# Altium project ePBR25_ACU_Controller.PrjPCB (part 1 of 2)
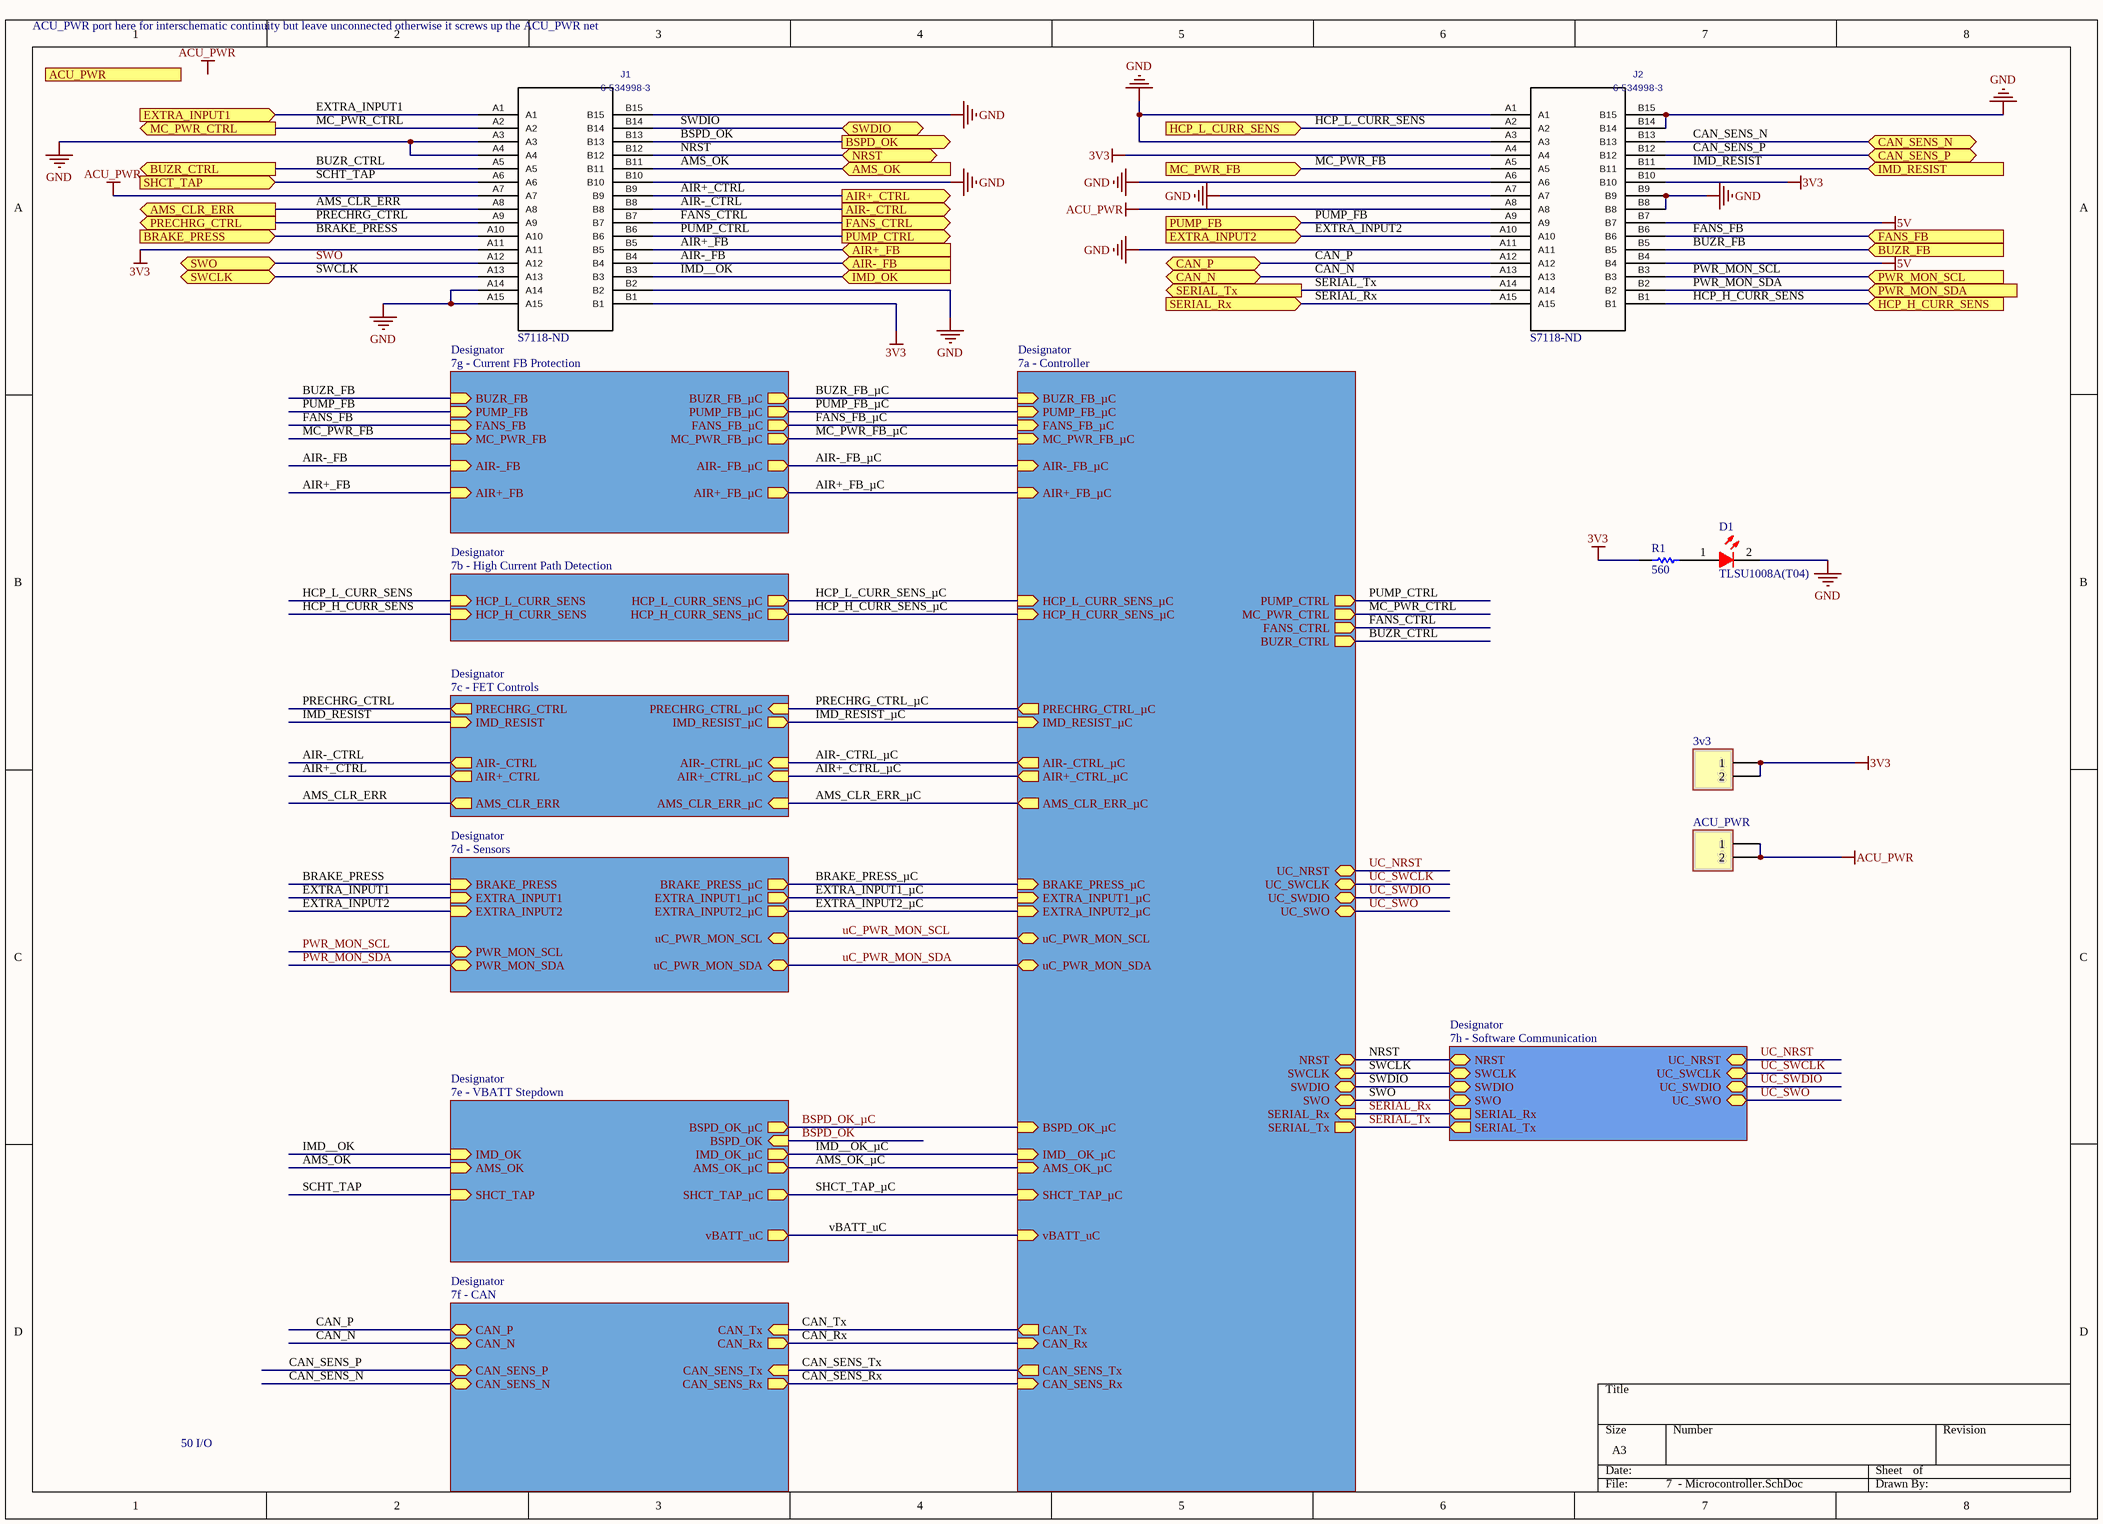
[diagram p0: 7  - Microcontroller.SchDoc]
9 sheets, 150 parts. Net scope: hierarchical (ports join the sheet entries above them; power ports are global).
Board file: ePBR25_ACU_Controller_rev0.PcbDoc
Sheets:
  7  - Microcontroller.SchDoc
    Designator = 7a - Controller.SchDoc
    Designator = 7b - High Current Path Detection.SchDoc
    Designator = 7c - FET Controls.SchDoc
    Designator = 7d - Sensors.SchDoc
    Designator = 7e - VBATT Stepdown.SchDoc
    Designator = 7f - CAN.SchDoc
    Designator = 7g - Current FB Protection.SchDoc
    Designator = 7h - Software Communication.SchDoc

## Sheet 7  - Microcontroller.SchDoc
size A3

### Parts
3v3  (no value)  [HDR1X2]
ACU_PWR  (no value)  [HDR1X2]
D1  TLSU1008A(T04)  [TOSH-0603LED_RED_V]
J1  6-534998-3  Supplier Part Number 1: S7118-ND  [6-534998-5_6-534998-5(Primary)]
J2  6-534998-3  Supplier Part Number 1: S7118-ND  [6-534998-5_6-534998-5(Primary)]
R1  560  [RESC0603(1608)_L]

### Sub-sheets
Designator = 7a - Controller: HCP_L_CURR_SENS_µC (in), HCP_H_CURR_SENS_µC (in), PRECHRG_CTRL_µC (out), IMD_RESIST_µC (in), AIR-_CTRL_µC (out), AIR+_CTRL_µC (out), AMS_CLR_ERR_µC (out), EXTRA_INPUT1_µC (in), EXTRA_INPUT2_µC (in), IMD__OK_µC (in), AMS_OK_µC (in), SHCT_TAP_µC (in), CAN_Tx (out), CAN_Rx (in), PUMP_CTRL (out), MC_PWR_CTRL (out), FANS_CTRL (out), BUZR_CTRL (out), NRST (bidir), SWCLK (bidir), SWDIO (bidir), BUZR_FB_µC (in), FANS_FB_µC (in), MC_PWR_FB_µC (in), PUMP_FB_µC (in), CAN_SENS_Tx (out), CAN_SENS_Rx (in), BRAKE_PRESS_µC (in), BSPD_OK_µC (in), SWO (bidir), UC_NRST (bidir), UC_SWCLK (bidir), UC_SWDIO (bidir), UC_SWO (bidir), uC_PWR_MON_SCL (bidir), AIR-_FB_µC (in), AIR+_FB_µC (in), uC_PWR_MON_SDA (bidir), SERIAL_Rx (in), SERIAL_Tx (out), vBATT_uC (in)
Designator = 7b - High Current Path Detection: HCP_L_CURR_SENS (in), HCP_H_CURR_SENS (in), HCP_L_CURR_SENS_µC (out), HCP_H_CURR_SENS_µC (out)
Designator = 7c - FET Controls: PRECHRG_CTRL (out), IMD_RESIST (in), AIR-_CTRL (out), AIR+_CTRL (out), AMS_CLR_ERR (out), PRECHRG_CTRL_µC (in), IMD_RESIST_µC (out), AIR-_CTRL_µC (in), AIR+_CTRL_µC (in), AMS_CLR_ERR_µC (in)
Designator = 7d - Sensors: EXTRA_INPUT1 (in), EXTRA_INPUT2 (in), EXTRA_INPUT1_µC (out), EXTRA_INPUT2_µC (out), BRAKE_PRESS (in), BRAKE_PRESS_µC (out), uC_PWR_MON_SCL (bidir), uC_PWR_MON_SDA (bidir), PWR_MON_SCL (bidir), PWR_MON_SDA (bidir)
Designator = 7e - VBATT Stepdown: IMD_OK (in), AMS_OK (in), SHCT_TAP (in), IMD_OK_µC (out), AMS_OK_µC (out), SHCT_TAP_µC (out), BSPD_OK (in), BSPD_OK_µC (out), vBATT_uC (out)
Designator = 7f - CAN: CAN_Tx (in), CAN_Rx (out), CAN_P (bidir), CAN_N (bidir), CAN_SENS_P (bidir), CAN_SENS_N (bidir), CAN_SENS_Tx (in), CAN_SENS_Rx (out)
Designator = 7g - Current FB Protection: BUZR_FB (in), PUMP_FB (in), FANS_FB (in), MC_PWR_FB (in), BUZR_FB_µC (out), PUMP_FB_µC (out), FANS_FB_µC (out), MC_PWR_FB_µC (out), AIR-_FB (in), AIR+_FB (in), AIR-_FB_µC (out), AIR+_FB_µC (out)
Designator = 7h - Software Communication: NRST (bidir), SWCLK (bidir), SWDIO (bidir), SWO (bidir), UC_NRST (bidir), UC_SWCLK (bidir), UC_SWDIO (bidir), UC_SWO (bidir), SERIAL_Rx (out), SERIAL_Tx (out)

### Ports
ACU_PWR (in), AIR+_CTRL (out), AIR+_FB (in), AIR-_CTRL (out), AIR-_FB (in), AMS_CLR_ERR (out), AMS_OK (in), BRAKE_PRESS (in), BSPD_OK (out), BUZR_CTRL (out), BUZR_FB (in), CAN_N (bidir), CAN_P (bidir), CAN_SENS_N (bidir), CAN_SENS_P (bidir), EXTRA_INPUT1 (in), EXTRA_INPUT2 (in), FANS_CTRL (out), FANS_FB (in), HCP_H_CURR_SENS (in), HCP_L_CURR_SENS (in), IMD_OK (in), IMD_RESIST (in), MC_PWR_CTRL (out), MC_PWR_FB (in), NRST (bidir), PRECHRG_CTRL (out), PUMP_CTRL (out), PUMP_FB (in), PWR_MON_SCL (in), PWR_MON_SDA (in), SERIAL_Rx (in), SERIAL_Tx (out), SHCT_TAP (in), SWCLK (bidir), SWDIO (bidir), SWO (bidir)

### Nets
3V3: 3v3.1 3v3.2 J1.A11 J1.B1 J2.A4 J2.B10 R1.1
5V: J2.B4 J2.B7
ACU_PWR: ACU_PWR.1 ACU_PWR.2 J1.A7 J2.A8
GND: D1.2(K) J1.A3 J1.A4 J1.A14 J1.A15 J1.B2 J1.B10 J1.B15 J2.A1 J2.A3 J2.A6 J2.A7 J2.A11 J2.B8 J2.B9 J2.B14 J2.B15
AIR+_CTRL: J1.B9 ; port AIR+_CTRL, sheet Designator/AIR+_CTRL
AIR+_CTRL_µC: sheet Designator/AIR+_CTRL_µC, sheet Designator/AIR+_CTRL_µC
AIR+_FB: J1.B5 ; port AIR+_FB, sheet Designator/AIR+_FB
AIR+_FB_µC: sheet Designator/AIR+_FB_µC, sheet Designator/AIR+_FB_µC
AIR-_CTRL: J1.B8 ; port AIR-_CTRL, sheet Designator/AIR-_CTRL
AIR-_CTRL_µC: sheet Designator/AIR-_CTRL_µC, sheet Designator/AIR-_CTRL_µC
AIR-_FB: J1.B4 ; port AIR-_FB, sheet Designator/AIR-_FB
AIR-_FB_µC: sheet Designator/AIR-_FB_µC, sheet Designator/AIR-_FB_µC
AMS_CLR_ERR: J1.A8 ; port AMS_CLR_ERR, sheet Designator/AMS_CLR_ERR
AMS_CLR_ERR_µC: sheet Designator/AMS_CLR_ERR_µC, sheet Designator/AMS_CLR_ERR_µC
AMS_OK: J1.B11 ; port AMS_OK, sheet Designator/AMS_OK
AMS_OK_µC: sheet Designator/AMS_OK_µC, sheet Designator/AMS_OK_µC
BRAKE_PRESS: J1.A10 ; port BRAKE_PRESS, sheet Designator/BRAKE_PRESS
BRAKE_PRESS_µC: sheet Designator/BRAKE_PRESS_µC, sheet Designator/BRAKE_PRESS_µC
BSPD_OK: J1.B13 ; port BSPD_OK, sheet Designator/BSPD_OK
BSPD_OK_µC: sheet Designator/BSPD_OK_µC, sheet Designator/BSPD_OK_µC
BUZR_CTRL: J1.A5 ; port BUZR_CTRL, sheet Designator/BUZR_CTRL
BUZR_FB: J2.B5 ; port BUZR_FB, sheet Designator/BUZR_FB
BUZR_FB_µC: sheet Designator/BUZR_FB_µC, sheet Designator/BUZR_FB_µC
CAN_N: J2.A13 ; port CAN_N, sheet Designator/CAN_N
CAN_P: J2.A12 ; port CAN_P, sheet Designator/CAN_P
CAN_Rx: sheet Designator/CAN_Rx, sheet Designator/CAN_Rx
CAN_SENS_N: J2.B13 ; port CAN_SENS_N, sheet Designator/CAN_SENS_N
CAN_SENS_P: J2.B12 ; port CAN_SENS_P, sheet Designator/CAN_SENS_P
CAN_SENS_Rx: sheet Designator/CAN_SENS_Rx, sheet Designator/CAN_SENS_Rx
CAN_SENS_Tx: sheet Designator/CAN_SENS_Tx, sheet Designator/CAN_SENS_Tx
CAN_Tx: sheet Designator/CAN_Tx, sheet Designator/CAN_Tx
EXTRA_INPUT1: J1.A1 ; port EXTRA_INPUT1, sheet Designator/EXTRA_INPUT1
EXTRA_INPUT1_µC: sheet Designator/EXTRA_INPUT1_µC, sheet Designator/EXTRA_INPUT1_µC
EXTRA_INPUT2: J2.A10 ; port EXTRA_INPUT2, sheet Designator/EXTRA_INPUT2
EXTRA_INPUT2_µC: sheet Designator/EXTRA_INPUT2_µC, sheet Designator/EXTRA_INPUT2_µC
FANS_CTRL: J1.B7 ; port FANS_CTRL, sheet Designator/FANS_CTRL
FANS_FB: J2.B6 ; port FANS_FB, sheet Designator/FANS_FB
FANS_FB_µC: sheet Designator/FANS_FB_µC, sheet Designator/FANS_FB_µC
HCP_H_CURR_SENS: J2.B1 ; port HCP_H_CURR_SENS, sheet Designator/HCP_H_CURR_SENS
HCP_H_CURR_SENS_µC: sheet Designator/HCP_H_CURR_SENS_µC, sheet Designator/HCP_H_CURR_SENS_µC
HCP_L_CURR_SENS: J2.A2 ; port HCP_L_CURR_SENS, sheet Designator/HCP_L_CURR_SENS
HCP_L_CURR_SENS_µC: sheet Designator/HCP_L_CURR_SENS_µC, sheet Designator/HCP_L_CURR_SENS_µC
IMD__OK: J1.B3 ; port IMD_OK, sheet Designator/IMD_OK
IMD__OK_µC: sheet Designator/IMD__OK_µC, sheet Designator/IMD_OK_µC
IMD_RESIST: J2.B11 ; port IMD_RESIST, sheet Designator/IMD_RESIST
IMD_RESIST_µC: sheet Designator/IMD_RESIST_µC, sheet Designator/IMD_RESIST_µC
MC_PWR_CTRL: J1.A2 ; port MC_PWR_CTRL, sheet Designator/MC_PWR_CTRL
MC_PWR_FB: J2.A5 ; port MC_PWR_FB, sheet Designator/MC_PWR_FB
MC_PWR_FB_µC: sheet Designator/MC_PWR_FB_µC, sheet Designator/MC_PWR_FB_µC
NRST: J1.B12 ; port NRST, sheet Designator/NRST, sheet Designator/NRST
PRECHRG_CTRL: J1.A9 ; port PRECHRG_CTRL, sheet Designator/PRECHRG_CTRL
PRECHRG_CTRL_µC: sheet Designator/PRECHRG_CTRL_µC, sheet Designator/PRECHRG_CTRL_µC
PUMP_CTRL: J1.B6 ; port PUMP_CTRL, sheet Designator/PUMP_CTRL
PUMP_FB: J2.A9 ; port PUMP_FB, sheet Designator/PUMP_FB
PUMP_FB_µC: sheet Designator/PUMP_FB_µC, sheet Designator/PUMP_FB_µC
PWR_MON_SCL: J2.B3 ; port PWR_MON_SCL, sheet Designator/PWR_MON_SCL
PWR_MON_SDA: J2.B2 ; port PWR_MON_SDA, sheet Designator/PWR_MON_SDA
SCHT_TAP: J1.A6 ; port SHCT_TAP, sheet Designator/SHCT_TAP
SERIAL_Rx: J2.A15 ; port SERIAL_Rx, sheet Designator/SERIAL_Rx, sheet Designator/SERIAL_Rx
SERIAL_Tx: J2.A14 ; port SERIAL_Tx, sheet Designator/SERIAL_Tx, sheet Designator/SERIAL_Tx
SHCT_TAP_µC: sheet Designator/SHCT_TAP_µC, sheet Designator/SHCT_TAP_µC
SWCLK: J1.A13 ; port SWCLK, sheet Designator/SWCLK, sheet Designator/SWCLK
SWDIO: J1.B14 ; port SWDIO, sheet Designator/SWDIO, sheet Designator/SWDIO
SWO: J1.A12 ; port SWO, sheet Designator/SWO, sheet Designator/SWO
UC_NRST: sheet Designator/UC_NRST, sheet Designator/UC_NRST
uC_PWR_MON_SCL: sheet Designator/uC_PWR_MON_SCL, sheet Designator/uC_PWR_MON_SCL
uC_PWR_MON_SDA: sheet Designator/uC_PWR_MON_SDA, sheet Designator/uC_PWR_MON_SDA
UC_SWCLK: sheet Designator/UC_SWCLK, sheet Designator/UC_SWCLK
UC_SWDIO: sheet Designator/UC_SWDIO, sheet Designator/UC_SWDIO
UC_SWO: sheet Designator/UC_SWO, sheet Designator/UC_SWO
vBATT_uC: sheet Designator/vBATT_uC, sheet Designator/vBATT_uC
NetD1_1: D1.1(A) R1.2

### Notes on the sheet
- ACU_PWR port here for interschematic continuity but leave unconnected otherwise it screws up the ACU_PWR net
- 50 I/O
- Labels drawn without touching a wire or pin: ACU_PWR

### Library data of the parts
3v3 ACU_PWR = Header 2: Header, 2-Pin; LatestRevisionDate: 17-Jul-2002; LatestRevisionNote: Re-released for DXP Platform.; Publisher: Altium Limited
D1 = CMP-0444-00001-1: LED, Red 0603 (1608) 63mCd; Manufacturer: Toshiba; Forward Current: 25 mA; Power Dissipation: 60 mW; Packing Type: Reel; Reverse Voltage: 4 V; Mounting Technology: Surface Mount; PackageDescription: 2-Pin SMT LED, 1.6 x 0.8 mm Pitch; ComponentLink1URL: http://www.toshiba-components.com/; ComponentLink1Description: Manufacturer URL; PackageReference: 0603LED_RED; PartNumber: TLSU1008A(T04); ComponentLink2URL: http://www.semicon.toshiba.co.jp/info/docget.jsp?type=datasheet&lang=en&pid=TLSU1008A(T04); ComponentLink2Description: Datasheet; DatasheetVersion: Aug-08; Storage Temperature: -40 to 100 degC
J1 J2 = 6-534998-3: C: Copyright (C) 2015 Accelerated Designs. All rights reserved; Vendor: TE Connectivity; Built_By: EMA_UL_Team; Value: 6-534998-3; Manufacturer_Part_Number: 6-534998-3; Supplier 1: Digi-Key
R1 = CMP-1591-00001-1: 0603 (1608 Metric) Chip Resistor; Case-Metric: 1608; Case-EIA: 0603; PackageReference: RESC0603(1608)

## Sheet 7a - Controller.SchDoc
size 355 x 241 mm
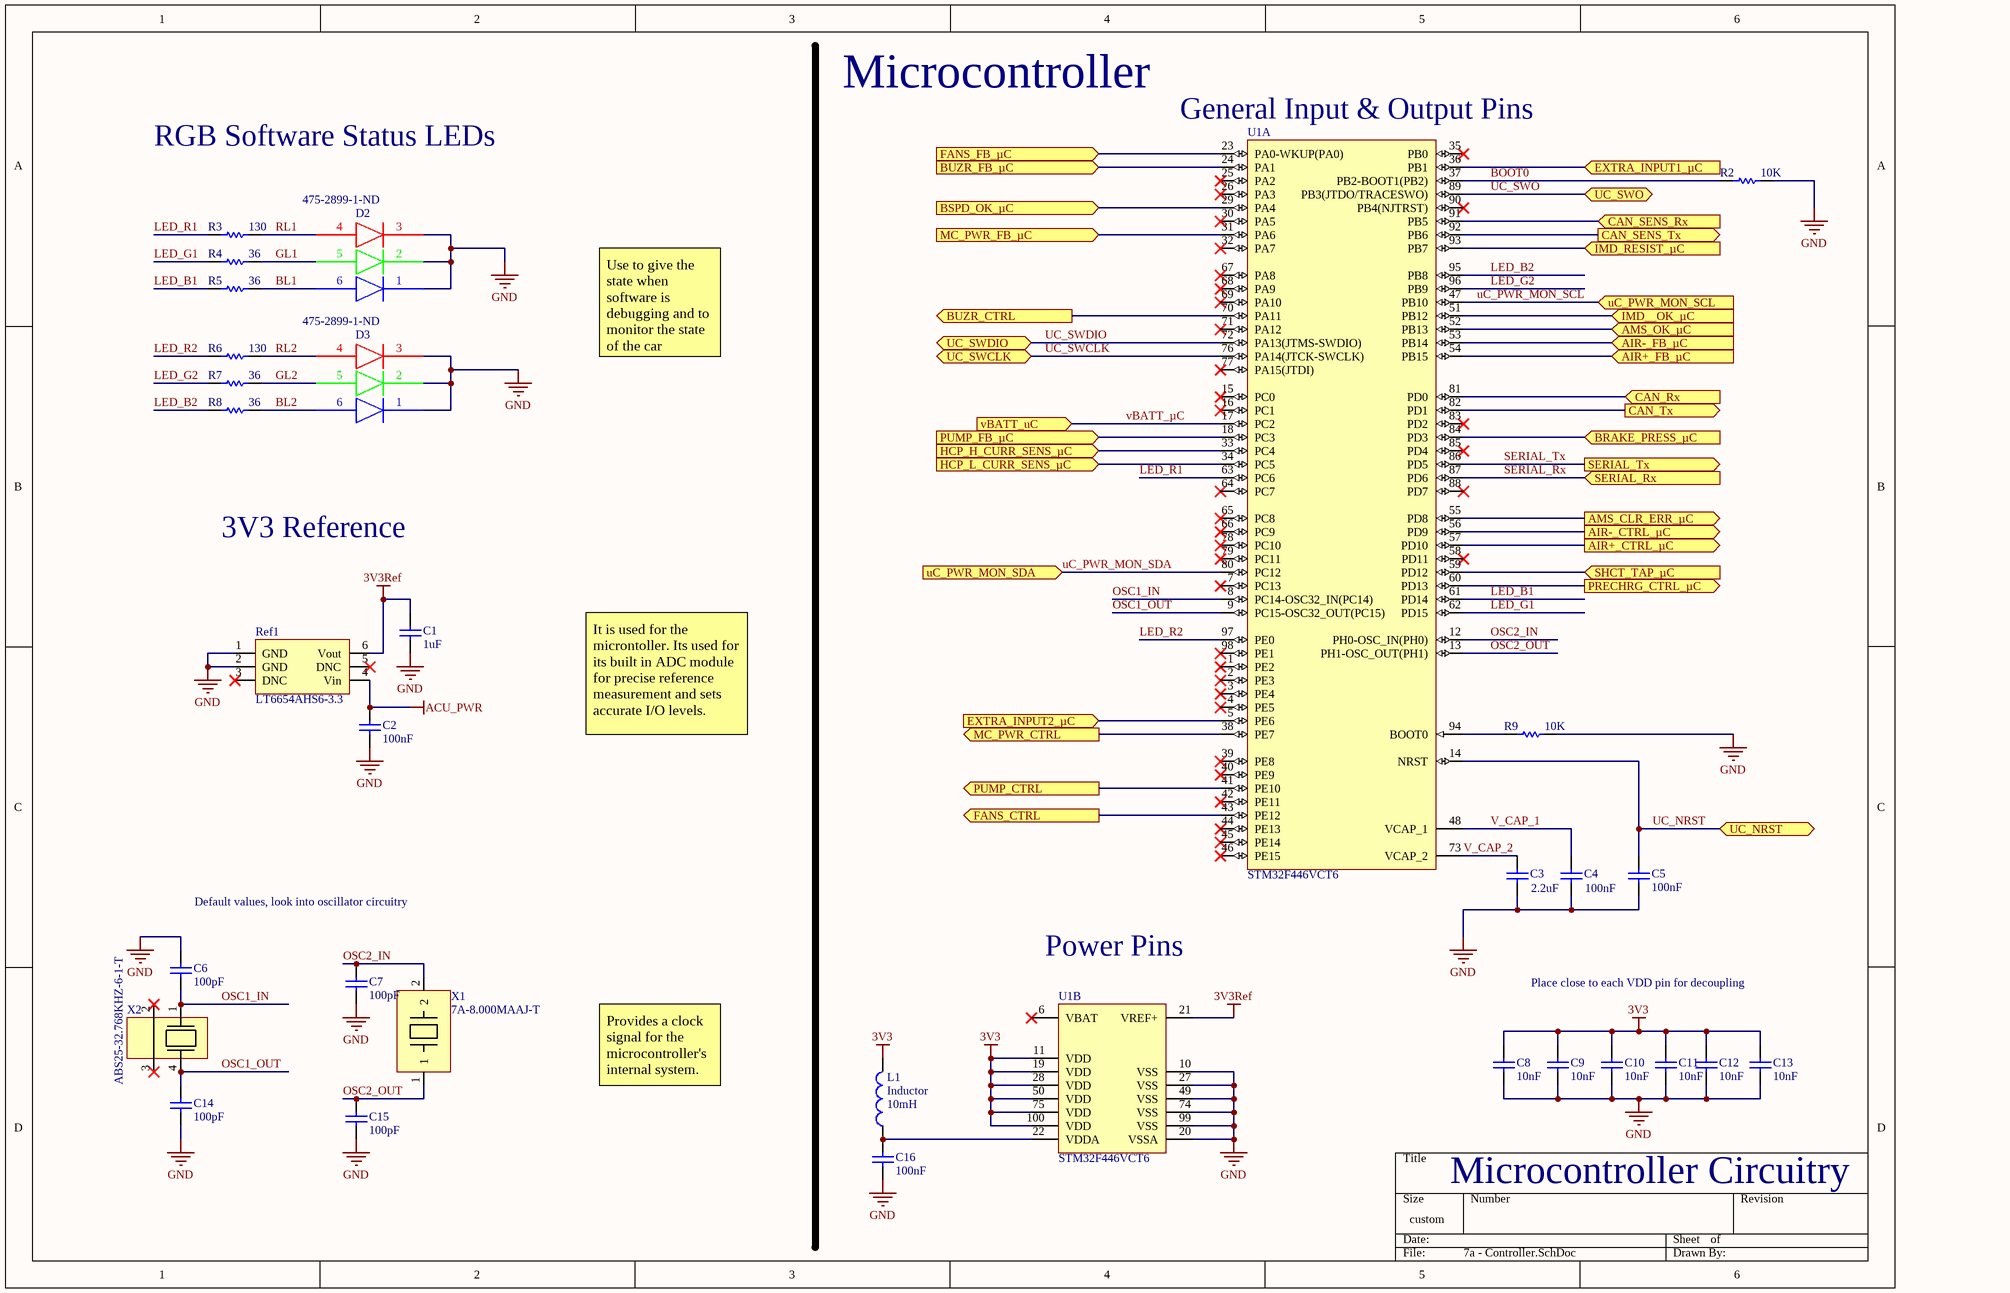
[diagram p1: 7a - Controller.SchDoc]

### Parts
C1  value 1uF  [1608[0603]]  (hidden comment: Cap)
C2  value 100nF  [1608[0603]]  (hidden comment: Cap)
C3  2.2uF  [CAPC0603(1608)100_N]
C4  100nF  [CAPC0603(1608)100_N]
C5  value 100nF  [1608[0603]]  (hidden comment: Cap)
C6  value 100pF  [1608[0603]]  (hidden comment: Cap)
C7  value 100pF  [1608[0603]]  (hidden comment: Cap)
C8  value 10nF  [1608[0603]]  (hidden comment: Cap)
C9  value 10nF  [1608[0603]]  (hidden comment: Cap)
C10  value 10nF  [1608[0603]]  (hidden comment: Cap)
C11  value 10nF  [1608[0603]]  (hidden comment: Cap)
C12  value 10nF  [1608[0603]]  (hidden comment: Cap)
C13  value 10nF  [1608[0603]]  (hidden comment: Cap)
C14  value 100pF  [1608[0603]]  (hidden comment: Cap)
C15  value 100pF  [1608[0603]]  (hidden comment: Cap)
C16  value 100nF  [1608[0603]]  (hidden comment: Cap)
D2  Supplier Part Number 1: 475-2899-1-ND  [CLX6C-FKB]
D3  Supplier Part Number 1: 475-2899-1-ND  [CLX6C-FKB]
L1  Inductor  value 10mH  [0402-A]
R2  value 10K  [1608[0603]]  (hidden comment: Res1)
R3  value 130  [1608[0603]]  (hidden comment: Res1)
R4  value 36  [1608[0603]]  (hidden comment: Res1)
R5  value 36  [1608[0603]]  (hidden comment: Res1)
R6  value 130  [1608[0603]]  (hidden comment: Res1)
R7  value 36  [1608[0603]]  (hidden comment: Res1)
R8  value 36  [1608[0603]]  (hidden comment: Res1)
R9  value 10K  [1608[0603]]  (hidden comment: Res1)
Ref1  LT6654AHS6-3.3  [TSOT-23]
U1  STM32F446VCT6  [STM-LQFP100_L]  (parts A,B of 2)
X1  7A-8.000MAAJ-T  [5 x 3.2 mm SMD]
X2  ABS25-32.768KHZ-6-1-T  [SOJ-4, 5.5mm Pitch]

### Ports
AIR+_CTRL_µC (out), AIR+_FB_µC (in), AIR-_CTRL_µC (out), AIR-_FB_µC (in), AMS_CLR_ERR_µC (out), AMS_OK_µC (in), BRAKE_PRESS_µC (in), BSPD_OK_µC (in), BUZR_CTRL (out), BUZR_FB_µC (in), CAN_Rx (in), CAN_SENS_Rx (in), CAN_SENS_Tx (out), CAN_Tx (out), EXTRA_INPUT1_µC (in), EXTRA_INPUT2_µC (in), FANS_CTRL (out), FANS_FB_µC (in), HCP_H_CURR_SENS_µC (in), HCP_L_CURR_SENS_µC (in), IMD__OK_µC (in), IMD_RESIST_µC (in), MC_PWR_CTRL (out), MC_PWR_FB_µC (in), PRECHRG_CTRL_µC (out), PUMP_CTRL (out), PUMP_FB_µC (in), SERIAL_Rx (in), SERIAL_Tx (out), SHCT_TAP_µC (in), UC_NRST (bidir), uC_PWR_MON_SCL (in), uC_PWR_MON_SDA (in), UC_SWCLK (bidir), UC_SWDIO (bidir), UC_SWO (bidir), vBATT_uC (in)

### Nets
3V3: C8.2 C9.2 C10.2 C11.2 C12.2 C13.2 L1.2 U1.11(VDD) U1.19(VDD) U1.28(VDD) U1.50(VDD) U1.75(VDD) U1.100(VDD)
3V3Ref: C1.2 Ref1.6(Vout) U1.21(VREF+)
ACU_PWR: C2.2 Ref1.4(Vin)
GND: C1.1 C2.1 C3.1 C4.1 C5.1 C6.2 C7.1 C8.1 C9.1 C10.1 C11.1 C12.1 C13.1 C14.1 C15.1 C16.1 D2.1(B) D2.2(G) D2.3(R) D3.1(B) D3.2(G) D3.3(R) R2.2 R9.2 Ref1.1(GND) Ref1.2(GND) U1.10(VSS) U1.20(VSSA) U1.27(VSS) U1.49(VSS) U1.74(VSS) U1.99(VSS)
AIR+_CTRL_µC: U1.57(PD10) ; port AIR+_CTRL_µC
AIR+_FB_µC: U1.54(PB15) ; port AIR+_FB_µC
AIR-_CTRL_µC: U1.56(PD9) ; port AIR-_CTRL_µC
AIR-_FB_µC: U1.53(PB14) ; port AIR-_FB_µC
AMS_CLR_ERR_µC: U1.55(PD8) ; port AMS_CLR_ERR_µC
AMS_OK_µC: U1.52(PB13) ; port AMS_OK_µC
BL1: D2.6(B) R5.2
BL2: D3.6(B) R8.2
BOOT0: R2.1 U1.37(PB2-BOOT1(PB2))
BRAKE_PRESS_µC: U1.84(PD3) ; port BRAKE_PRESS_µC
BSPD_OK_µC: U1.29(PA4) ; port BSPD_OK_µC
BUZR_CTRL: U1.70(PA11) ; port BUZR_CTRL
BUZR_FB_µC: U1.24(PA1) ; port BUZR_FB_µC
CAN_Rx: U1.81(PD0) ; port CAN_Rx
CAN_SENS_Rx: U1.91(PB5) ; port CAN_SENS_Rx
CAN_SENS_Tx: U1.92(PB6) ; port CAN_SENS_Tx
CAN_Tx: U1.82(PD1) ; port CAN_Tx
EXTRA_INPUT1_µC: U1.36(PB1) ; port EXTRA_INPUT1_µC
EXTRA_INPUT2_µC: U1.5(PE6) ; port EXTRA_INPUT2_µC
FANS_CTRL: U1.43(PE12) ; port FANS_CTRL
FANS_FB_µC: U1.23(PA0-WKUP(PA0)) ; port FANS_FB_µC
GL1: D2.5(G) R4.2
GL2: D3.5(G) R7.2
HCP_H_CURR_SENS_µC: U1.33(PC4) ; port HCP_H_CURR_SENS_µC
HCP_L_CURR_SENS_µC: U1.34(PC5) ; port HCP_L_CURR_SENS_µC
IMD__OK_µC: U1.51(PB12) ; port IMD__OK_µC
IMD_RESIST_µC: U1.93(PB7) ; port IMD_RESIST_µC
LED_B1: R5.1 U1.61(PD14)
LED_B2: R8.1 U1.95(PB8)
LED_G1: R4.1 U1.62(PD15)
LED_G2: R7.1 U1.96(PB9)
LED_R1: R3.1 U1.63(PC6)
LED_R2: R6.1 U1.97(PE0)
MC_PWR_CTRL: U1.38(PE7) ; port MC_PWR_CTRL
MC_PWR_FB_µC: U1.31(PA6) ; port MC_PWR_FB_µC
OSC1_IN: C6.1 U1.8(PC14-OSC32_IN(PC14)) X2.1
OSC1_OUT: C14.2 U1.9(PC15-OSC32_OUT(PC15)) X2.4
OSC2_IN: C7.2 U1.12(PH0-OSC_IN(PH0)) X1.2
OSC2_OUT: C15.2 U1.13(PH1-OSC_OUT(PH1)) X1.1
PRECHRG_CTRL_µC: U1.60(PD13) ; port PRECHRG_CTRL_µC
PUMP_CTRL: U1.41(PE10) ; port PUMP_CTRL
PUMP_FB_µC: U1.18(PC3) ; port PUMP_FB_µC
RL1: D2.4(R) R3.2
RL2: D3.4(R) R6.2
SERIAL_Rx: U1.87(PD6) ; port SERIAL_Rx
SERIAL_Tx: U1.86(PD5) ; port SERIAL_Tx
SHCT_TAP_µC: U1.59(PD12) ; port SHCT_TAP_µC
UC_NRST: C5.2 U1.14(NRST) ; port UC_NRST
uC_PWR_MON_SCL: U1.47(PB10) ; port uC_PWR_MON_SCL
uC_PWR_MON_SDA: U1.80(PC12) ; port uC_PWR_MON_SDA
UC_SWCLK: U1.76(PA14(JTCK-SWCLK)) ; port UC_SWCLK
UC_SWDIO: U1.72(PA13(JTMS-SWDIO)) ; port UC_SWDIO
UC_SWO: U1.89(PB3(JTDO/TRACESWO)) ; port UC_SWO
V_CAP_1: C4.2 U1.48(VCAP_1)
V_CAP_2: C3.2 U1.73(VCAP_2)
vBATT_µC: U1.17(PC2) ; port vBATT_uC  [project net vBATT_uC]
NetC16_2: C16.2 L1.1 U1.22(VDDA)
NetR9_1: R9.1 U1.94(BOOT0)

Not connected (* = marked no-connect by the designer): Ref1 3(DNC)* 5(DNC)*; U1 1(PE2)* 2(PE3)* 3(PE4)* 4(PE5)* 6(VBAT)* 7(PC13)* 15(PC0)* 16(PC1)* 25(PA2)* 26(PA3)* 30(PA5)* 32(PA7)* 35(PB0)* 39(PE8)* 40(PE9)* 42(PE11)* 44(PE13)* 45(PE14)* 46(PE15)* 58(PD11)* 64(PC7)* 65(PC8)* 66(PC9)* 67(PA8)* 68(PA9)* 69(PA10)* 71(PA12)* 77(PA15(JTDI))* 78(PC10)* 79(PC11)* 83(PD2)* 85(PD4)* 88(PD7)* 90(PB4(NJTRST))* 98(PE1)*; X2 2* 3*

### Notes on the sheet
- Microcontroller
- RGB Software Status LEDs
- (near U1) General Input & Output Pins
- Use to give the state when software is debugging and to monitor the state of the car
- 3V3 Reference
- It is used for the microntoller. Its used for its built in ADC module for precise reference measurement and sets accurate I/O levels.
- Default values, look into oscillator circuitry
- Power Pins
- Place close to each VDD pin for decoupling
- Provides a clock signal for the microcontroller's internal system.
- Microcontroller Circuitry

### Library data of the parts
C1 C2 C5-C16 = Cap: Capacitor; Published: 8-Jun-2000; LatestRevisionDate: 17-Jul-2002; LatestRevisionNote: Re-released for DXP Platform.; PackageReference: RAD-0.3; Publisher: Altium Limited; PackageDescription: Radial Cap, Thru-Hole; 2 Leads; 0.3 in Pin Spacing
C3 C4 = CMP-1035-02582-1: CAP 100nF 10V -20% to +80% 0603 (1608 Metric) Thickness 1mm SMD; Case-Metric: 1608; Case-EIA: 0603; Rated Voltage: 10 V; Value: 100nF; Technology: SMT; Max Thickness: 1 mm; Tolerance: -20% to +80%
D2 D3 = LED - CLX6C-FKB-CGJKNCFBB789363 RGB: Manufacturer: Cree Inc.; Color: Red, Green, Blue (RGB); Lens Color: White; Lens Transparency: Diffused; Millicandela Rating: 420mcd Red, 840mcd Green, 196mcd Blue; Lens Style/Size: Square with Flat Top, 1.00mm; Voltage - Forward (Vf) (Typ): 1.9V Red, 3V Green, 3V Blue; Current - Test: 8mA Red, 8mA Green, 8mA Blue; Wavelength - Dominant: 622nm Red, 531nm Green, 470nm Blue; Manufacturer Part Number: CLX6C-FKB-CGJKNCFBB789363; RoHS: RoHS Compliant; Category: Optoelectronics; Packaging: Cut Tape (CT); Part Status: Active; Viewing Angle: -; Mounting Type: Surface Mount; Wavelength - Peak: -; Features: -; Package / Case: 6-SMD, J-Lead; Supplier Device Package: 6-PLCC; Size / Dimension: 3.40mm L x 3.40mm W; Height (Max): 2.90mm; ComponentLink1URL: http://www.cree.com/~/media/Files/Cree/LED-Components-and-Modules/HB/Data-Sheets/1281-CLX6C-FKB.pdf; ComponentLink1Description: http://www.cree.com/~/media/Files/Cree/LED-Components-and-Modules/HB/Data-Sheets/1281-CLX6C-FKB.pdf; Supplier 1: Digi-Key
L1 = Inductor: Code_IEC: 1005; Published: 8-Jun-2000; LatestRevisionDate: 29-May-2009; LatestRevisionNote: IPC-7351 Footprint Added.; PackageReference: 0402-A; Publisher: Altium Limited; PackageDescription: Chip Inductor; Code_JEITA: 0402
R2-R9 = Res1: Resistor; Published: 8-Jun-2000; LatestRevisionDate: 17-Jul-2002; LatestRevisionNote: Re-released for DXP Platform.; PackageReference: AXIAL-0.3; Publisher: Altium Limited; PackageDescription: Axial Device, Thru-Hole; 2 Leads; 0.3 in Pin Spacing
Ref1 = LT6654AHS6-3.3: TSOT-23-56; Manufacturer: Linear Technology; Reference Type: Series; Output Type: Fixed; Voltage - Output (Min/Fixed): 3.3V; Current - Output: 10mA; Tolerance: ±0.05%; Temperature Coefficient: 10ppm/°C; Noise - 0.1Hz to 10Hz: 1.7ppmp-p; Noise - 10Hz to 10kHz: 2ppmrms; Voltage - Input: 3.8 V ~ 36 V; Current - Supply: 600µA; Manufacturer Part Number: LT6654AHS6-3.3; Digikey Part Number: LT6654AHS6-3.3#TRMPBFCT-ND; Digikey Link: http://www.digikey.com/product-detail/en/linear-technology/LT6654AHS6-3.3-TRMPBF/LT6654AHS6-3.3-TRMPBFCT-ND/2485839; Supplier 1: Digi-Key; Supplier Part Number 1: LT6654AHS6-3.3#TRMPBFCT-ND; RoHS: RoHS Compliant; Category: Integrated Circuits (ICs); Stock 1: 1315; Pricing 1: 1=9.53, 25=8.508, 100=5.5596, 250=5.1048 (CAD); Packaging: Cut Tape (CT); Part Status: Active; Voltage - Output (Max): -; Current - Cathode: -; Operating Temperature: -40°C ~ 125°C (TA); Mounting Type: Surface Mount; Package / Case: SOT-23-6 Thin, TSOT-23-6; Supplier Device Package: TSOT-23-6; ComponentLink1URL: http://www.linear.com/docs/29677; ComponentLink1Description: http://www.linear.com/docs/29677
U1 = CMP-0243-00219-1: ARM Cortex-M4 32-bit MCU+FPU, 256 KB Flash, 128 KB Internal RAM, 81 I/Os, 100-Pin LQFP, -40 to 85 degC, Tray; D/A Converter: 2; Operating Frequency(F) (Processor speed) (MHz): 180; I/Os (High Current): 81; Supply Voltage(Vcc) min (V): 1.7; Internal RAM Size (kB): 128; FLASH Size (Prog) (kB): 256; Package Reference: 100-Pin Low Profile Quad Flat Package, Body 14 x 14 mm, Pitch 0.5 mm; Packing: Tray; ComponentLink1URL: http://www.st.com/; ComponentLink1Description: Manufacturer URL; ComponentLink2URL: http://www.st.com/st-web-ui/static/active/en/resource/technical/document/datasheet/DM00141306.pdf; Mounting Technology: Surface Mount; DatasheetVersion: Rev. 6; ComponentLink2Description: Datasheet; Core: ARM Cortex-M4; Package Description: LQFP100
X1 = 8MHz crystal, 7A-8.000MAAJ-T: Manufacturer: TXC CORPORATION; Frequency: 8MHz; Frequency Stability: ±30ppm; Load Capacitance: 18pF; ESR (Equivalent Series Resistance): 80 Ohm; Operating Mode: Fundamental; Supplier 1: Digi-Key; Manufacturer Part Number: 7A-8.000MAAJ-T; RoHS: RoHS Compliant; Category: Crystals, Oscillators, Resonators; Stock 1: 30692; Pricing 1: 1=1.12, 10=0.989, 50=0.9234, 100=0.8162, 500=0.77322 (CAD); Packaging: Cut Tape (CT); Part Status: Active; Type: MHz Crystal; Frequency Tolerance: ±30ppm; Operating Temperature: -20°C ~ 70°C; Ratings: -; Mounting Type: Surface Mount; Package / Case: 2-SMD, No Lead; Size / Dimension: 0.197" L x 0.126" W (5.00mm x 3.20mm); Height - Seated (Max): 0.053" (1.35mm); ComponentLink1URL: http://www.txccrystal.com/images/pdf/7a.pdf; ComponentLink1Description: http://www.txccrystal.com/images/pdf/7a.pdf; Supplier Part Number 1: 887-1448-1-ND
X2 = ABS25-32.768KHZ-6-1-T: Manufacturer: Abracon LLC; Frequency Tolerance: ±10ppm; Load Capacitance: 6pF; ESR (Equivalent Series Resistance): 50 kOhm; Operating Mode: Fundamental; Frequency: 32.768kHz; Manufacturer Part Number: ABS25-32.768KHZ-6-1-T; Digikey Part Number: 535-10241-1-ND; Digikey Link: http://www.digikey.ca/product-detail/en/abracon-llc/ABS25-32.768KHZ-6-1-T/535-10241-1-ND/2218054; Supplier 1: Digi-Key; Supplier Part Number 1: 535-10241-1-ND; RoHS: RoHS Compliant; Category: Crystals, Oscillators, Resonators; Stock 1: 47244; Pricing 1: 1=1, 10=0.837, 50=0.7538, 100=0.6701, 500=0.63664, 1000=0.5361 (CAD); Packaging: Cut Tape (CT); Part Status: Active; Type: kHz Crystal (Tuning Fork); Frequency Stability: -; Operating Temperature: -40°C ~ 85°C; Ratings: -; Mounting Type: Surface Mount; Package / Case: 4-SOJ, 5.50mm pitch; Size / Dimension: 0.315" L x 0.150" W (8.00mm x 3.80mm); Height - Seated (Max): 0.098" (2.50mm); ComponentLink1URL: http://www.abracon.com/Resonators/abs25.pdf; ComponentLink1Description: http://www.abracon.com/Resonators/abs25.pdf

## Sheet 7b - High Current Path Detection.SchDoc
size A4
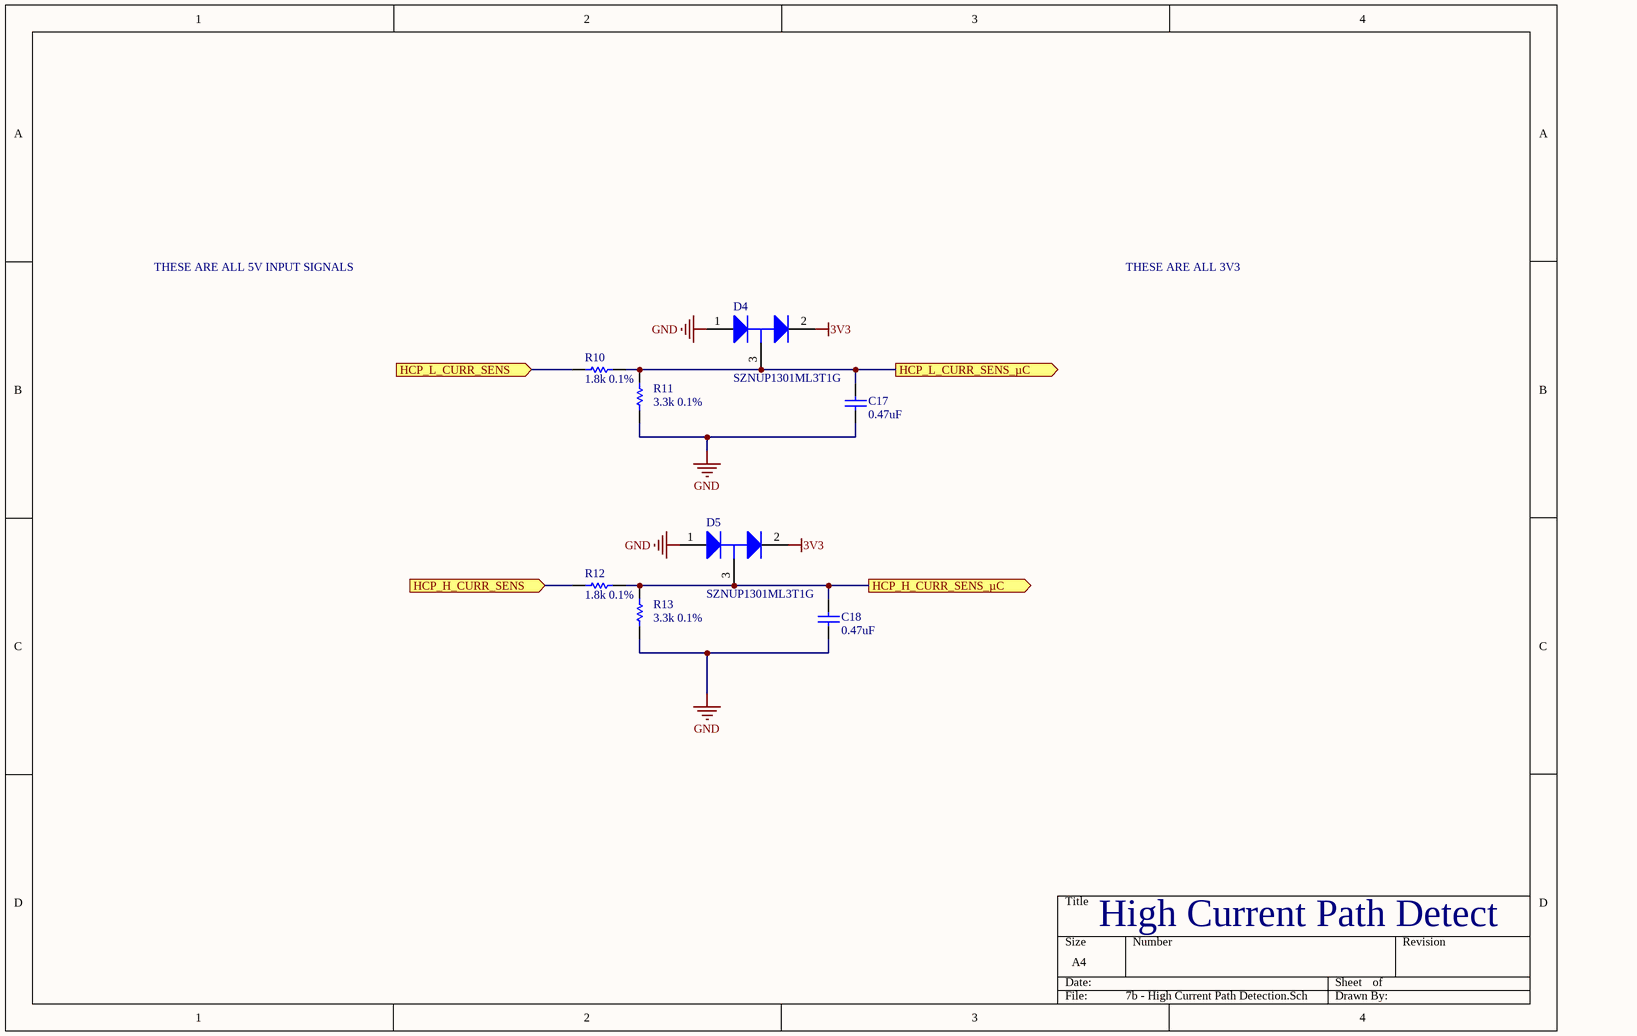
[diagram p2: 7b - High Current Path Detection.SchDoc]

### Parts
C17  value 0.47uF  [1608[0603]]  (hidden comment: Cap)
C18  value 0.47uF  [1608[0603]]  (hidden comment: Cap)
D4  SZNUP1301ML3T1G  [ONSC-SOT-23-3-318-08_V]
D5  SZNUP1301ML3T1G  [ONSC-SOT-23-3-318-08_V]
R10  value 1.8k 0.1%  [1608[0603]]  (hidden comment: Res1)
R11  value 3.3k 0.1%  [1608[0603]]  (hidden comment: Res1)
R12  value 1.8k 0.1%  [1608[0603]]  (hidden comment: Res1)
R13  value 3.3k 0.1%  [1608[0603]]  (hidden comment: Res1)

### Ports
HCP_H_CURR_SENS (in), HCP_H_CURR_SENS_µC (out), HCP_L_CURR_SENS (in), HCP_L_CURR_SENS_µC (out)

### Nets
3V3: D4.2(K) D5.2(K)
GND: C17.1 C18.1 D4.1(A) D5.1(A) R11.1 R13.1
HCP_H_CURR_SENS: R12.2 ; port HCP_H_CURR_SENS
HCP_H_CURR_SENS_µC: C18.2 D5.3(K/A) R12.1 R13.2 ; port HCP_H_CURR_SENS_µC
HCP_L_CURR_SENS: R10.2 ; port HCP_L_CURR_SENS
HCP_L_CURR_SENS_µC: C17.2 D4.3(K/A) R10.1 R11.2 ; port HCP_L_CURR_SENS_µC

### Notes on the sheet
- THESE ARE ALL 5V INPUT SIGNALS
- THESE ARE ALL 3V3
- High Current Path Detect

### Library data of the parts
C17 C18 = Cap: Capacitor; Published: 8-Jun-2000; LatestRevisionDate: 17-Jul-2002; LatestRevisionNote: Re-released for DXP Platform.; PackageReference: RAD-0.3; Publisher: Altium Limited; PackageDescription: Radial Cap, Thru-Hole; 2 Leads; 0.3 in Pin Spacing
D4 D5 = CMP-1063-00171-1: Low Capacitance Diode Array for ESD Protection in a Single Data Line, 3-Pin SOT-23, Pb-Free, Tape and Reel; Manufacturer: On Semiconductor; C Max (pF): 0.9; Direction: Bidirectional; V(BR) Min (V): 70; Number of Lines: 1; Mounting Technology: Surface Mount; PackageReference: SOT-23-3-318-08; DatasheetVersion: Rev. 6; PackageVersion: Rev. AP, 11/2009; RoHS: Pb-Free; ComponentLink1Description: Manufacturer URL; ComponentLink1URL: http://www.onsemi.com/; PackageDescription: 3-Pin Small Outline Transistor, Body 2.92 x 1.3 mm, Pitch 0.95 mm; PartNumber: SZNUP1301ML3T1G; Packing: Tape and Reel; ComponentLink3URL: http://www.onsemi.cn/pub_link/Collateral/318-08.PDF; ComponentLink3Description: Package Specification; VRWM Max (V): 70; ComponentLink2Description: Datasheet; ComponentLink2URL: http://www.onsemi.cn/pub_link/Collateral/NUP1301ML3T1-D.PDF
R10-R13 = Res1: Resistor; Published: 8-Jun-2000; LatestRevisionDate: 17-Jul-2002; LatestRevisionNote: Re-released for DXP Platform.; PackageReference: AXIAL-0.3; Publisher: Altium Limited; PackageDescription: Axial Device, Thru-Hole; 2 Leads; 0.3 in Pin Spacing

## Sheet 7c - FET Controls.SchDoc
size A4
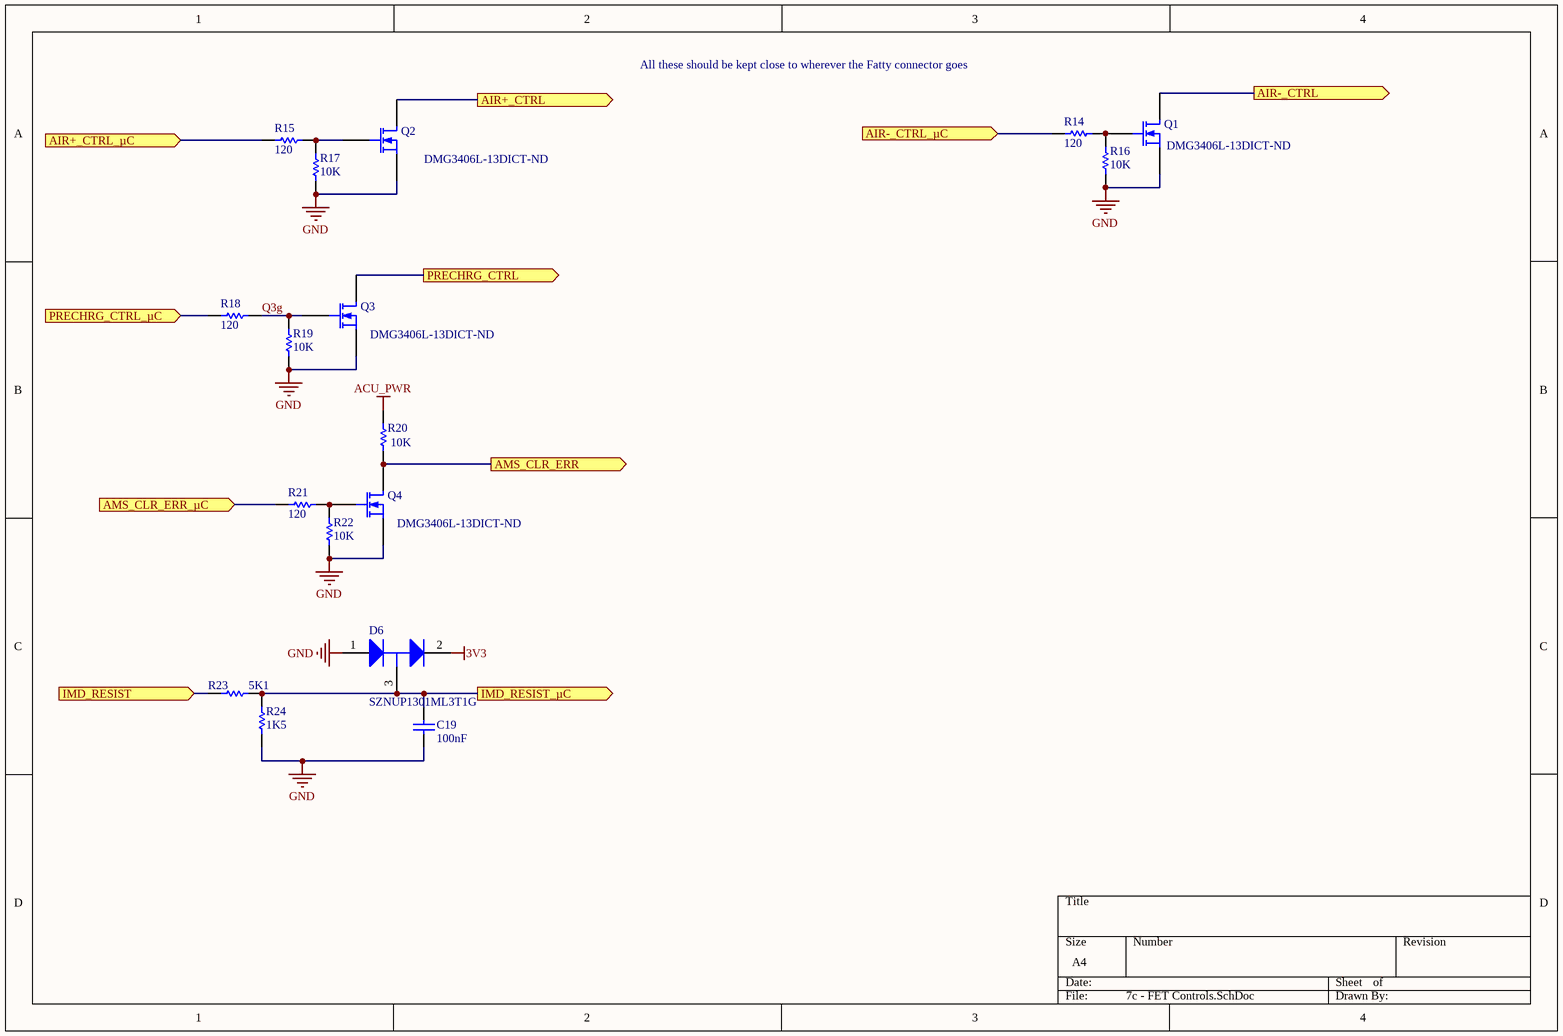
[diagram p3: 7c - FET Controls.SchDoc]

### Parts
C19  value 100nF  [1608[0603]]  (hidden comment: Cap)
D6  SZNUP1301ML3T1G  [ONSC-SOT-23-3-318-08_V]
Q1  Supplier Part Number 1: DMG3406L-13DICT-ND  [SOT-23_N]
Q2  Supplier Part Number 1: DMG3406L-13DICT-ND  [SOT-23_N]
Q3  Supplier Part Number 1: DMG3406L-13DICT-ND  [SOT-23_N]
Q4  Supplier Part Number 1: DMG3406L-13DICT-ND  [SOT-23_N]
R14  120  [1608[0603]]
R15  120  [1608[0603]]
R16  10K  [1608[0603]]
R17  10K  [1608[0603]]
R18  120  [1608[0603]]
R19  10K  [1608[0603]]
R20  10K  [1608[0603]]
R21  120  [1608[0603]]
R22  10K  [1608[0603]]
R23  value 5K1  [1608[0603]]  (hidden comment: Res1)
R24  value 1K5  [1608[0603]]  (hidden comment: Res1)

### Ports
AIR+_CTRL (out), AIR+_CTRL_µC (in), AIR-_CTRL (out), AIR-_CTRL_µC (in), AMS_CLR_ERR (out), AMS_CLR_ERR_µC (in), IMD_RESIST (in), IMD_RESIST_µC (out), PRECHRG_CTRL (out), PRECHRG_CTRL_µC (in)

### Nets
3V3: D6.2(K)
ACU_PWR: R20.2
GND: C19.1 D6.1(A) Q1.2(S) Q2.2(S) Q3.2(S) Q4.2(S) R16.1 R17.1 R19.1 R22.1 R24.1
AIR+_CTRL: Q2.3(D) ; port AIR+_CTRL
AIR+_CTRL_µC: R15.1 ; port AIR+_CTRL_µC
AIR-_CTRL: Q1.3(D) ; port AIR-_CTRL
AIR-_CTRL_µC: R14.1 ; port AIR-_CTRL_µC
AMS_CLR_ERR: Q4.3(D) R20.1 ; port AMS_CLR_ERR
AMS_CLR_ERR_µC: R21.1 ; port AMS_CLR_ERR_µC
IMD_RESIST: R23.1 ; port IMD_RESIST
IMD_RESIST_µC: C19.2 D6.3(K/A) R23.2 R24.2 ; port IMD_RESIST_µC
PRECHRG_CTRL: Q3.3(D) ; port PRECHRG_CTRL
PRECHRG_CTRL_µC: R18.1 ; port PRECHRG_CTRL_µC
Q3g: Q3.1(G) R18.2 R19.2
NetQ1_1: Q1.1(G) R14.2 R16.2
NetQ2_1: Q2.1(G) R15.2 R17.2
NetQ4_1: Q4.1(G) R21.2 R22.2

### Notes on the sheet
- All these should be kept close to wherever the Fatty connector goes

### Library data of the parts
C19 = Cap: Capacitor; Published: 8-Jun-2000; LatestRevisionDate: 17-Jul-2002; LatestRevisionNote: Re-released for DXP Platform.; PackageReference: RAD-0.3; Publisher: Altium Limited; PackageDescription: Radial Cap, Thru-Hole; 2 Leads; 0.3 in Pin Spacing
D6 = CMP-1063-00171-1: as D4 on sheet 7b - High Current Path Detection; Mounting Technology: Surface Mount; PackageReference: SOT-23-3-318-08; DatasheetVersion: Rev. 6; PackageVersion: Rev. AP, 11/2009; RoHS: Pb-Free; ComponentLink1Description: Manufacturer URL; ComponentLink1URL: http://www.onsemi.com/; PackageDescription: 3-Pin Small Outline Transistor, Body 2.92 x 1.3 mm, Pitch 0.95 mm; PartNumber: SZNUP1301ML3T1G; Packing: Tape and Reel; ComponentLink3URL: http://www.onsemi.cn/pub_link/Collateral/318-08.PDF; ComponentLink3Description: Package Specification; VRWM Max (V): 70; ComponentLink2Description: Datasheet; ComponentLink2URL: http://www.onsemi.cn/pub_link/Collateral/NUP1301ML3T1-D.PDF
Q1-Q4 = MOSFET-N: N-Channel MOSFET; Manufacturer: Infineon Technologies; Manufacturer Part Number: IPD075N03L G; FET Type: MOSFET N-Channel, Metal Oxide; FET Feature: Logic Level Gate; Drain to Source Voltage (Vdss): 30V; Current - Continuous Drain (Id) @ 25°C: 50A (Tc); Rds On (Max) @ Id, Vgs: 7.5 mOhm @ 30A, 10V; Vgs(th) (Max) @ Id: 2.2V @ 250µA; Gate Charge (Qg) @ Vgs: 18nC @ 10V; Input Capacitance (Ciss) @ Vds: 1900pF @ 15V; Power - Max: 47W; Published: 8-Jun-2000; LatestRevisionDate: 17-Jul-2002; LatestRevisionNote: Re-released for DXP Platform.; PackageVersion: 1995/1996; PackageReference: E3; Publisher: Altium Limited; PackageDescription: TO, Flat Index; 3 In-Line, Axial Leads; Body Dia. 4.6mm; Lead Dia. 0.5 mm (max); RoHS: RoHS Compliant; Category: Discrete Semiconductor Products; Packaging: Cut Tape (CT); Mounting Type: Surface Mount; Package / Case: TO-252-3, DPak (2 Leads + Tab), SC-63; Supplier Device Package: PG-TO252-3; ComponentLink1URL: http://www.infineon.com/dgdl/Infineon-IPD075N03LG-DS-v02_01-en.pdf?folderId=5546d4694909da4801490a07012f053b&fileId=db3a30431936bc4b011951d824f83aeb; ComponentLink1Description: http://www.infineon.com/dgdl/Infineon-IPD075N03LG-DS-v02_01-en.pdf?folderId=5546d4694909da4801490a07012f053b&fileId=db3a30431936bc4b011951d824f83aeb; ComponentLink2URL: http://www.semicon.toshiba.co.jp/info/docget.jsp?type=datasheet&lang=en&pid=SSM3K329R; ComponentLink2Description: http://www.semicon.toshiba.co.jp/info/docget.jsp?type=datasheet&lang=en&pid=SSM3K329R; Supplier 1: Digi-Key
R14-R22 = Res1: Resistor; Value: 1K; Published: 8-Jun-2000; LatestRevisionDate: 17-Jul-2002; LatestRevisionNote: Re-released for DXP Platform.; PackageReference: AXIAL-0.3; Publisher: Altium Limited; PackageDescription: Axial Device, Thru-Hole; 2 Leads; 0.3 in Pin Spacing
R23 R24 = Res1: Resistor; Published: 8-Jun-2000; LatestRevisionDate: 17-Jul-2002; LatestRevisionNote: Re-released for DXP Platform.; PackageReference: AXIAL-0.3; Publisher: Altium Limited; PackageDescription: Axial Device, Thru-Hole; 2 Leads; 0.3 in Pin Spacing

## Sheet 7d - Sensors.SchDoc
size A4
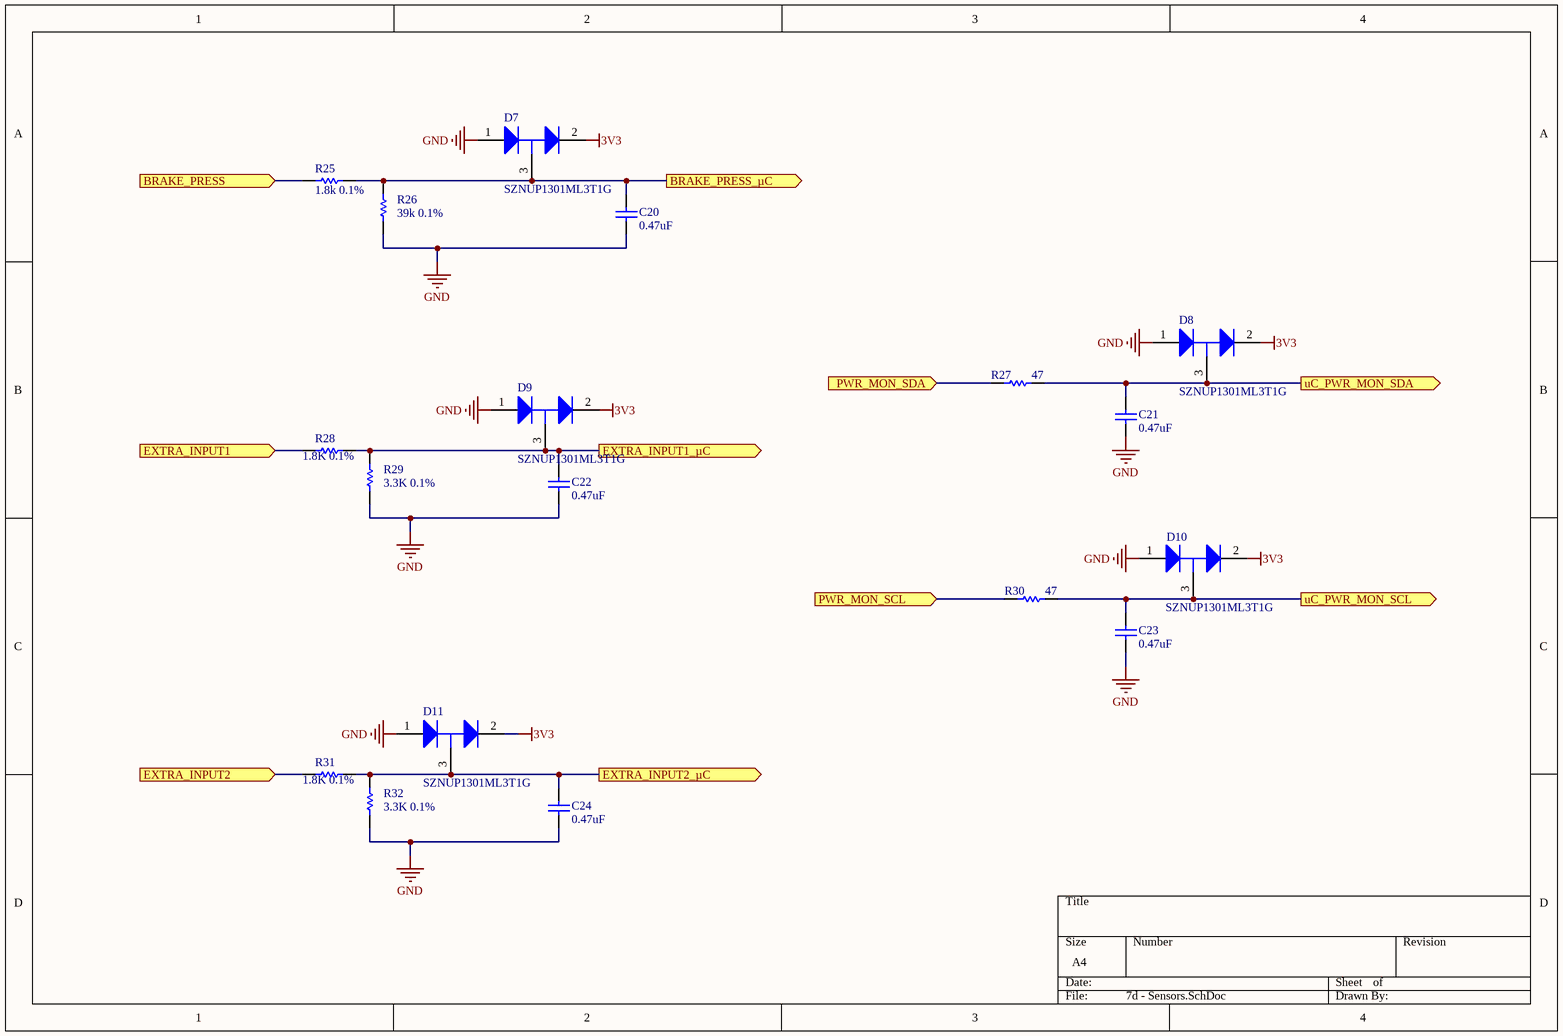
[diagram p4: 7d - Sensors.SchDoc]

### Parts
C20  value 0.47uF  [1608[0603]]  (hidden comment: Cap)
C21  value 0.47uF  [1608[0603]]  (hidden comment: Cap)
C22  value 0.47uF  [1608[0603]]  (hidden comment: Cap)
C23  value 0.47uF  [1608[0603]]  (hidden comment: Cap)
C24  value 0.47uF  [1608[0603]]  (hidden comment: Cap)
D7  SZNUP1301ML3T1G  [ONSC-SOT-23-3-318-08_V]
D8  SZNUP1301ML3T1G  [ONSC-SOT-23-3-318-08_V]
D9  SZNUP1301ML3T1G  [ONSC-SOT-23-3-318-08_V]
D10  SZNUP1301ML3T1G  [ONSC-SOT-23-3-318-08_V]
D11  SZNUP1301ML3T1G  [ONSC-SOT-23-3-318-08_V]
R25  value 1.8k 0.1%  [1608[0603]]  (hidden comment: Res1)
R26  value 39k 0.1%  [1608[0603]]  (hidden comment: Res1)
R27  value 47  [1608[0603]]  (hidden comment: Res1)
R28  value 1.8K 0.1%  [1608[0603]]  (hidden comment: Res1)
R29  value 3.3K 0.1%  [1608[0603]]  (hidden comment: Res1)
R30  value 47  [1608[0603]]  (hidden comment: Res1)
R31  value 1.8K 0.1%  [1608[0603]]  (hidden comment: Res1)
R32  value 3.3K 0.1%  [1608[0603]]  (hidden comment: Res1)

### Ports
BRAKE_PRESS (in), BRAKE_PRESS_µC (out), EXTRA_INPUT1 (in), EXTRA_INPUT1_µC (out), EXTRA_INPUT2 (in), EXTRA_INPUT2_µC (out), PWR_MON_SCL (in), PWR_MON_SDA (in), uC_PWR_MON_SCL (out), uC_PWR_MON_SDA (out)

### Nets
3V3: D7.2(K) D8.2(K) D9.2(K) D10.2(K) D11.2(K)
GND: C20.1 C21.1 C22.1 C23.1 C24.1 D7.1(A) D8.1(A) D9.1(A) D10.1(A) D11.1(A) R26.1 R29.1 R32.1
BRAKE_PRESS: R25.2 ; port BRAKE_PRESS
BRAKE_PRESS_µC: C20.2 D7.3(K/A) R25.1 R26.2 ; port BRAKE_PRESS_µC
EXTRA_INPUT1: R28.2 ; port EXTRA_INPUT1
EXTRA_INPUT1_µC: C22.2 D9.3(K/A) R28.1 R29.2 ; port EXTRA_INPUT1_µC
EXTRA_INPUT2: R31.2 ; port EXTRA_INPUT2
EXTRA_INPUT2_µC: C24.2 D11.3(K/A) R31.1 R32.2 ; port EXTRA_INPUT2_µC
PWR_MON_SCL: R30.1 ; port PWR_MON_SCL
PWR_MON_SDA: R27.1 ; port PWR_MON_SDA
uC_PWR_MON_SCL: C23.2 D10.3(K/A) R30.2 ; port uC_PWR_MON_SCL
uC_PWR_MON_SDA: C21.2 D8.3(K/A) R27.2 ; port uC_PWR_MON_SDA

### Library data of the parts
C20-C24 = Cap: Capacitor; Published: 8-Jun-2000; LatestRevisionDate: 17-Jul-2002; LatestRevisionNote: Re-released for DXP Platform.; PackageReference: RAD-0.3; Publisher: Altium Limited; PackageDescription: Radial Cap, Thru-Hole; 2 Leads; 0.3 in Pin Spacing
D7-D11 = CMP-1063-00171-1: as D4 on sheet 7b - High Current Path Detection; Mounting Technology: Surface Mount; PackageReference: SOT-23-3-318-08; DatasheetVersion: Rev. 6; PackageVersion: Rev. AP, 11/2009; RoHS: Pb-Free; ComponentLink1Description: Manufacturer URL; ComponentLink1URL: http://www.onsemi.com/; PackageDescription: 3-Pin Small Outline Transistor, Body 2.92 x 1.3 mm, Pitch 0.95 mm; PartNumber: SZNUP1301ML3T1G; Packing: Tape and Reel; ComponentLink3URL: http://www.onsemi.cn/pub_link/Collateral/318-08.PDF; ComponentLink3Description: Package Specification; VRWM Max (V): 70; ComponentLink2Description: Datasheet; ComponentLink2URL: http://www.onsemi.cn/pub_link/Collateral/NUP1301ML3T1-D.PDF
R25-R32 = Res1: Resistor; Published: 8-Jun-2000; LatestRevisionDate: 17-Jul-2002; LatestRevisionNote: Re-released for DXP Platform.; PackageReference: AXIAL-0.3; Publisher: Altium Limited; PackageDescription: Axial Device, Thru-Hole; 2 Leads; 0.3 in Pin Spacing

## Sheet 7e - VBATT Stepdown.SchDoc
size A4
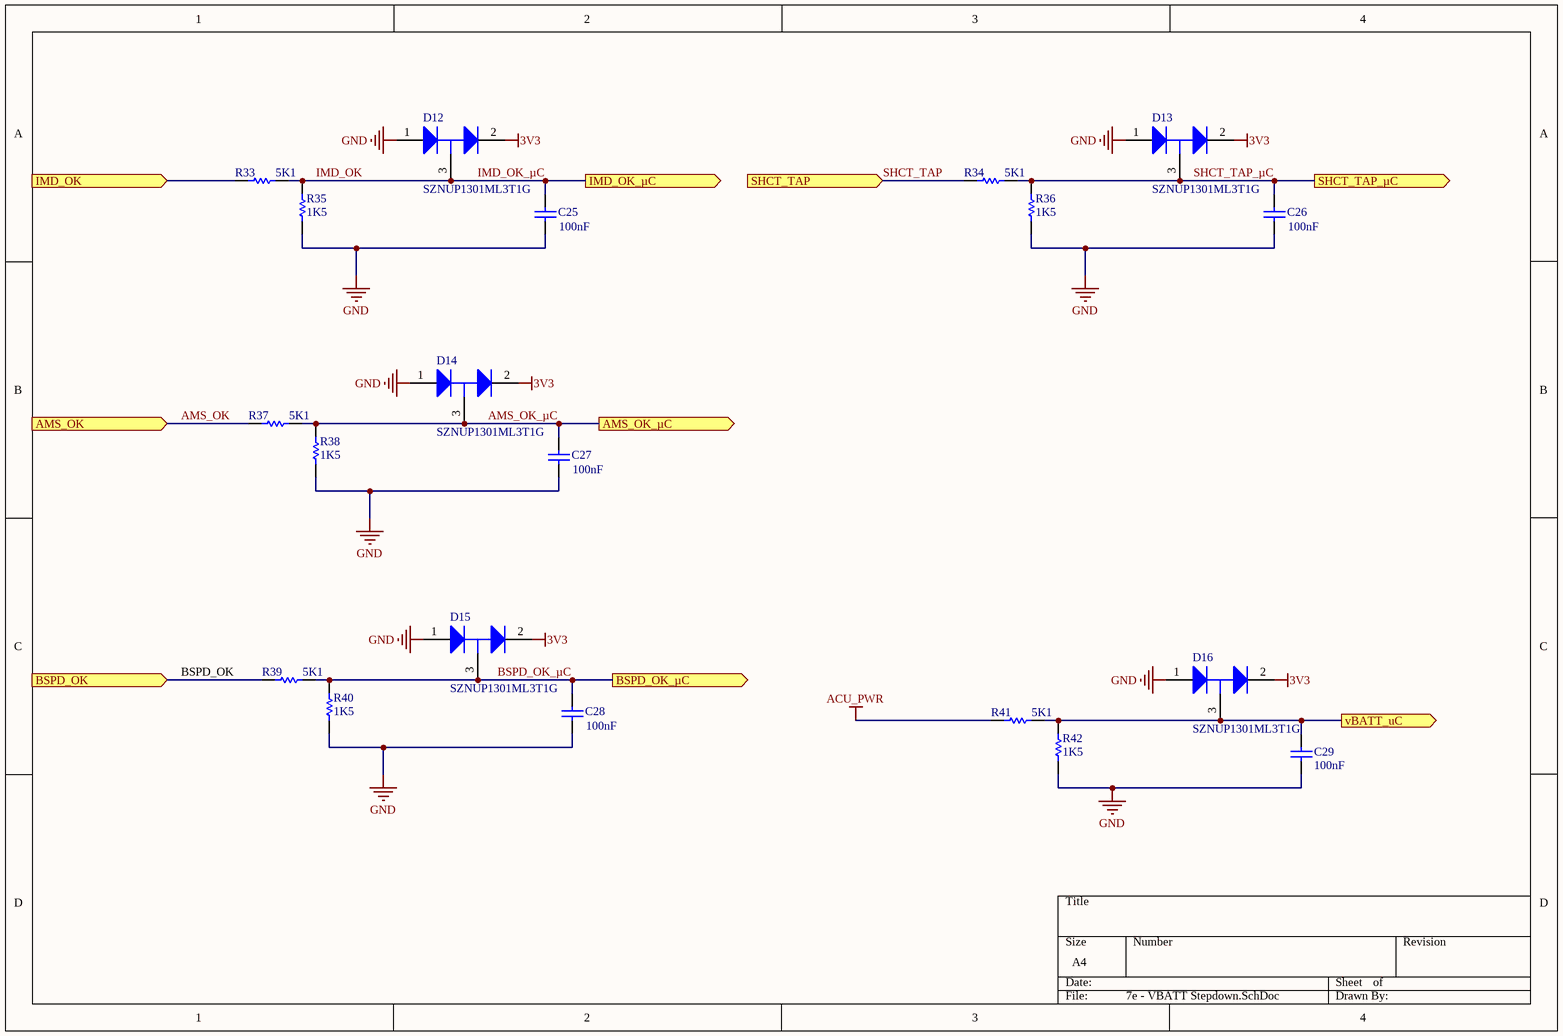
[diagram p5: 7e - VBATT Stepdown.SchDoc]

### Parts
C25  value 100nF  [1608[0603]]  (hidden comment: Cap)
C26  value 100nF  [1608[0603]]  (hidden comment: Cap)
C27  value 100nF  [1608[0603]]  (hidden comment: Cap)
C28  value 100nF  [1608[0603]]  (hidden comment: Cap)
C29  value 100nF  [1608[0603]]  (hidden comment: Cap)
D12  SZNUP1301ML3T1G  [ONSC-SOT-23-3-318-08_V]
D13  SZNUP1301ML3T1G  [ONSC-SOT-23-3-318-08_V]
D14  SZNUP1301ML3T1G  [ONSC-SOT-23-3-318-08_V]
D15  SZNUP1301ML3T1G  [ONSC-SOT-23-3-318-08_V]
D16  SZNUP1301ML3T1G  [ONSC-SOT-23-3-318-08_V]
R33  value 5K1  [1608[0603]]  (hidden comment: Res1)
R34  value 5K1  [1608[0603]]  (hidden comment: Res1)
R35  value 1K5  [1608[0603]]  (hidden comment: Res1)
R36  value 1K5  [1608[0603]]  (hidden comment: Res1)
R37  value 5K1  [1608[0603]]  (hidden comment: Res1)
R38  value 1K5  [1608[0603]]  (hidden comment: Res1)
R39  value 5K1  [1608[0603]]  (hidden comment: Res1)
R40  value 1K5  [1608[0603]]  (hidden comment: Res1)
R41  value 5K1  [1608[0603]]  (hidden comment: Res1)
R42  value 1K5  [1608[0603]]  (hidden comment: Res1)

### Ports
AMS_OK (in), AMS_OK_µC (out), BSPD_OK (in), BSPD_OK_µC (out), IMD_OK (in), IMD_OK_µC (out), SHCT_TAP (in), SHCT_TAP_µC (out), vBATT_uC (out)

### Nets
3V3: D12.2(K) D13.2(K) D14.2(K) D15.2(K) D16.2(K)
ACU_PWR: R41.1
GND: C25.1 C26.1 C27.1 C28.1 C29.1 D12.1(A) D13.1(A) D14.1(A) D15.1(A) D16.1(A) R35.1 R36.1 R38.1 R40.1 R42.1
AMS_OK: R37.1 ; port AMS_OK
AMS_OK_µC: C27.2 D14.3(K/A) R37.2 R38.2 ; port AMS_OK_µC
BSPD_OK: R39.1 ; port BSPD_OK
BSPD_OK_µC: C28.2 D15.3(K/A) R39.2 R40.2 ; port BSPD_OK_µC
IMD__OK: R33.1 ; port IMD_OK
IMD_OK: C25.2 D12.3(K/A) R33.2 R35.2 ; port IMD_OK_µC  [also labelled IMD_OK_µC]  [project net IMD__OK_µC]
SHCT_TAP: R34.1 ; port SHCT_TAP  [project net SCHT_TAP]
SHCT_TAP_µC: C26.2 D13.3(K/A) R34.2 R36.2 ; port SHCT_TAP_µC
vBATT_uC: C29.2 D16.3(K/A) R41.2 R42.2 ; port vBATT_uC

### Library data of the parts
C25-C29 = Cap: Capacitor; Published: 8-Jun-2000; LatestRevisionDate: 17-Jul-2002; LatestRevisionNote: Re-released for DXP Platform.; PackageReference: RAD-0.3; Publisher: Altium Limited; PackageDescription: Radial Cap, Thru-Hole; 2 Leads; 0.3 in Pin Spacing
D12-D16 = CMP-1063-00171-1: as D4 on sheet 7b - High Current Path Detection; Mounting Technology: Surface Mount; PackageReference: SOT-23-3-318-08; DatasheetVersion: Rev. 6; PackageVersion: Rev. AP, 11/2009; RoHS: Pb-Free; ComponentLink1Description: Manufacturer URL; ComponentLink1URL: http://www.onsemi.com/; PackageDescription: 3-Pin Small Outline Transistor, Body 2.92 x 1.3 mm, Pitch 0.95 mm; PartNumber: SZNUP1301ML3T1G; Packing: Tape and Reel; ComponentLink3URL: http://www.onsemi.cn/pub_link/Collateral/318-08.PDF; ComponentLink3Description: Package Specification; VRWM Max (V): 70; ComponentLink2Description: Datasheet; ComponentLink2URL: http://www.onsemi.cn/pub_link/Collateral/NUP1301ML3T1-D.PDF
R33-R42 = Res1: Resistor; Published: 8-Jun-2000; LatestRevisionDate: 17-Jul-2002; LatestRevisionNote: Re-released for DXP Platform.; PackageReference: AXIAL-0.3; Publisher: Altium Limited; PackageDescription: Axial Device, Thru-Hole; 2 Leads; 0.3 in Pin Spacing

## Sheet 7f - CAN.SchDoc
size A4
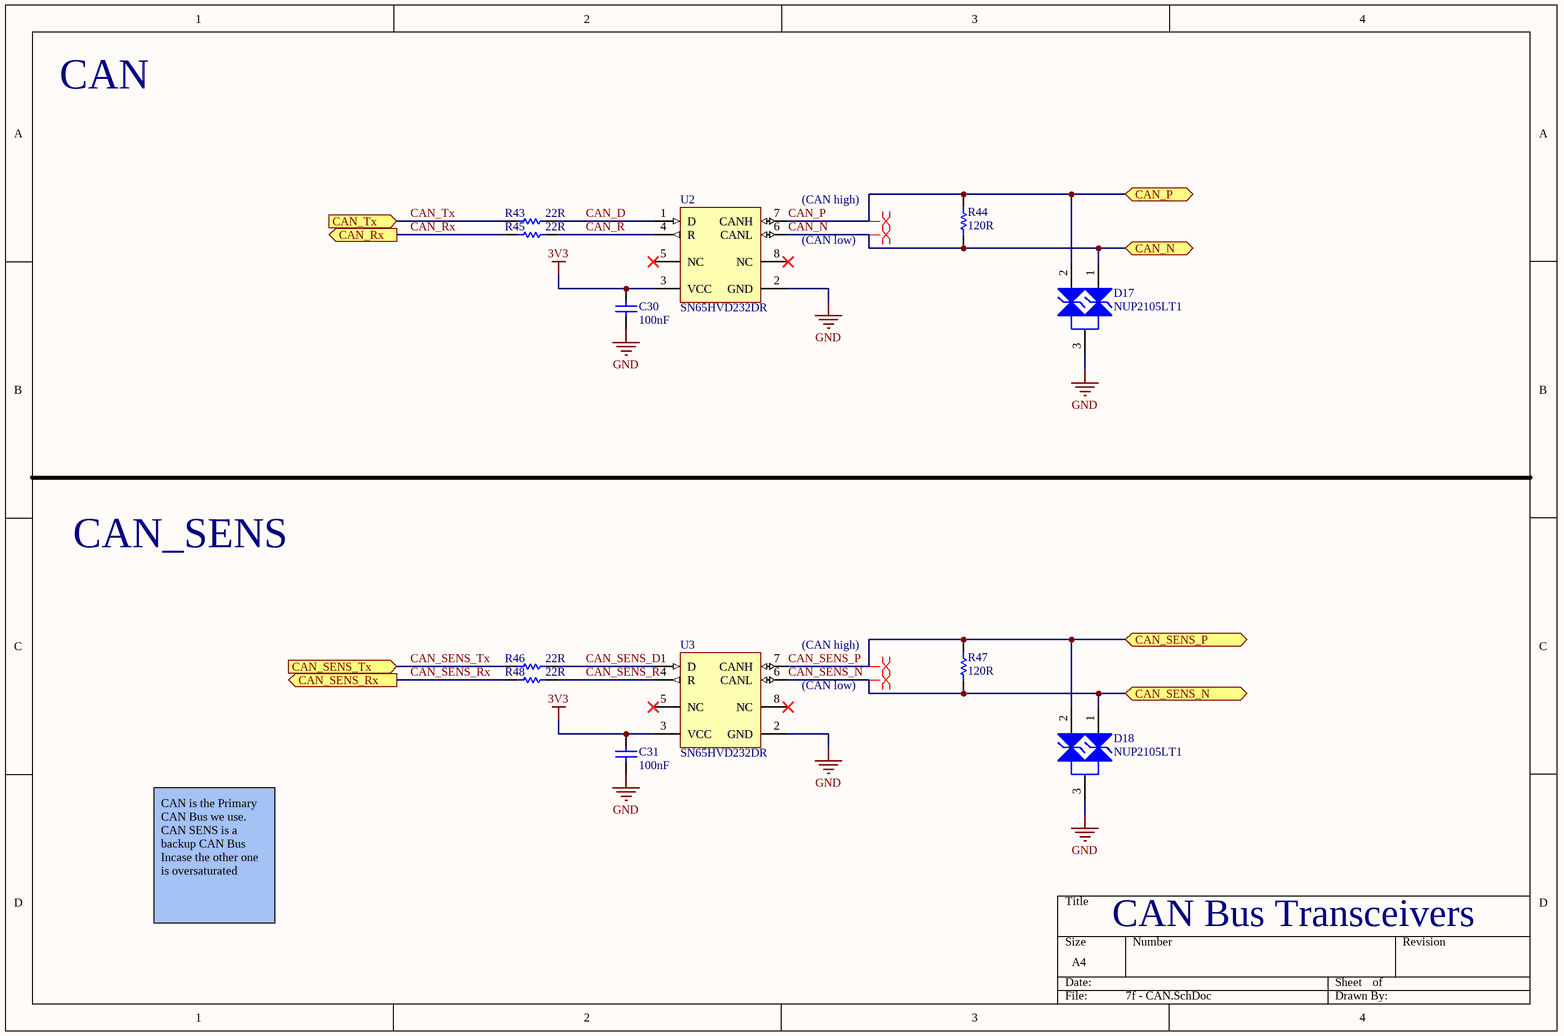
[diagram p6: 7f - CAN.SchDoc]

### Parts
C30  value 100nF  [1608[0603]]  (hidden comment: Cap)
C31  value 100nF  [1608[0603]]  (hidden comment: Cap)
D17  NUP2105LT1  [ONSC-SOT-23-3-318-08_V]
D18  NUP2105LT1  [ONSC-SOT-23-3-318-08_V]
R43  value 22R  [1608[0603]]  (hidden comment: Res1)
R44  value 120R  [1608[0603]]  (hidden comment: Res1)
R45  value 22R  [1608[0603]]  (hidden comment: Res1)
R46  value 22R  [1608[0603]]  (hidden comment: Res1)
R47  value 120R  [1608[0603]]  (hidden comment: Res1)
R48  value 22R  [1608[0603]]  (hidden comment: Res1)
U2  SN65HVD232DR  [D0008A_M]
U3  SN65HVD232DR  [D0008A_M]

### Ports
CAN_N (bidir), CAN_P (bidir), CAN_Rx (out), CAN_SENS_N (bidir), CAN_SENS_P (bidir), CAN_SENS_Rx (out), CAN_SENS_Tx (in), CAN_Tx (in)

### Nets
3V3: C30.2 C31.2 U2.3(VCC) U3.3(VCC)
GND: C30.1 C31.1 D17.3(K) D18.3(K) U2.2(GND) U3.2(GND)
CAN_D: R43.2 U2.1(D)
CAN_N: D17.1(K) R44.1 U2.6(CANL) ; port CAN_N
CAN_P: D17.2(K) R44.2 U2.7(CANH) ; port CAN_P
CAN_R: R45.2 U2.4(R)
CAN_Rx: R45.1 ; port CAN_Rx
CAN_SENS_D: R46.2 U3.1(D)
CAN_SENS_N: D18.1(K) R47.1 U3.6(CANL) ; port CAN_SENS_N
CAN_SENS_P: D18.2(K) R47.2 U3.7(CANH) ; port CAN_SENS_P
CAN_SENS_R: R48.2 U3.4(R)
CAN_SENS_Rx: R48.1 ; port CAN_SENS_Rx
CAN_SENS_Tx: R46.1 ; port CAN_SENS_Tx
CAN_Tx: R43.1 ; port CAN_Tx

Not connected (* = marked no-connect by the designer): U2 5(NC)* 8(NC)*; U3 5(NC)* 8(NC)*

### Layout directives
differential pair: CAN_N, CAN_P, CAN_SENS_N, CAN_SENS_P

### Notes on the sheet
- CAN
- (near U2) (CAN high)
- (near U2) (CAN low)
- CAN_SENS
- (near U3) (CAN high)
- (near U3) (CAN low)
- CAN is the Primary CAN Bus we use. CAN SENS is a backup CAN Bus Incase the other one is oversaturated
- CAN Bus Transceivers

### Library data of the parts
C30 C31 = Cap: Capacitor; Published: 8-Jun-2000; LatestRevisionDate: 17-Jul-2002; LatestRevisionNote: Re-released for DXP Platform.; PackageReference: RAD-0.3; Publisher: Altium Limited; PackageDescription: Radial Cap, Thru-Hole; 2 Leads; 0.3 in Pin Spacing
D17 D18 = CMP-1063-00165-1: Dual Line CAN Bus Protector, 3-Pin SOT-23, Tape and Reel; Manufacturer: On Semiconductor; PPK Max (W): 350; IR Max (uA): 0.1; Number of Lines: 2; V(BR) Min (V): 26.2; Direction: Bidirectional; C Max (pF): 30; PackageDescription: 3-Pin Small Outline Transistor, Body 2.92 x 1.3 mm, Pitch 0.95 mm; ComponentLink2URL: http://www.onsemi.cn/pub_link/Collateral/NUP2105L-D.PDF; ComponentLink3Description: Package Specification; ComponentLink2Description: Datasheet; ComponentLink1URL: http://www.onsemi.com/; Mounting Technology: Surface Mount; ComponentLink1Description: Manufacturer URL; Packing: Tape and Reel; PackageVersion: Rev. AP, 11/2009; PartNumber: NUP2105LT1; DatasheetVersion: Rev. 5; ComponentLink3URL: http://www.onsemi.cn/pub_link/Collateral/318-08.PDF; PackageReference: SOT-23-3-318-08
R43-R48 = Res1: Resistor; Published: 8-Jun-2000; LatestRevisionDate: 17-Jul-2002; LatestRevisionNote: Re-released for DXP Platform.; PackageReference: AXIAL-0.3; Publisher: Altium Limited; PackageDescription: Axial Device, Thru-Hole; 2 Leads; 0.3 in Pin Spacing
U2 U3 = CMP-0315-00075-2: 3.3 V Can Transceiver, 17 mA, -40 to 85 degC, 8-pin SOIC (D), Green (RoHS & no Sb/Br); Manufacturer: Texas Instruments; Supply Voltage(s)(V): 3.3; Receivers Per Package: 1; ICC(Max)(mA): 17; Rating: Catalog; Transient Pulse Protection(V): -25 to 25; Mounting Technology: Surface Mount; PartNumber: SN65HVD232DR; Code_JEDEC: MS-012AA; Eco-Plan: Green (RoHS & no Sb/Br); Isolated: No; SubFamily: CAN; Footprint: SN65HVD232; Drivers Per Package: 1; ComponentLink1URL: http://www.ti.com/general/docs/lit/getliterature.tsp?genericPartNumber=SN65HVD232&fileType=pdf; ComponentLink1Description: Datasheet; PackageDescription: 8-Pin Plastic Small Outline Integrated Circuit, 4.9 x 3.9 mm, Pitch 1.27 mm Pitch; PackageReference: D0008A; DatasheetVersion: SLOS346K; PackageVersion: revM, Jun-2011

## Sheet 7g - Current FB Protection.SchDoc
size 304 x 193 mm
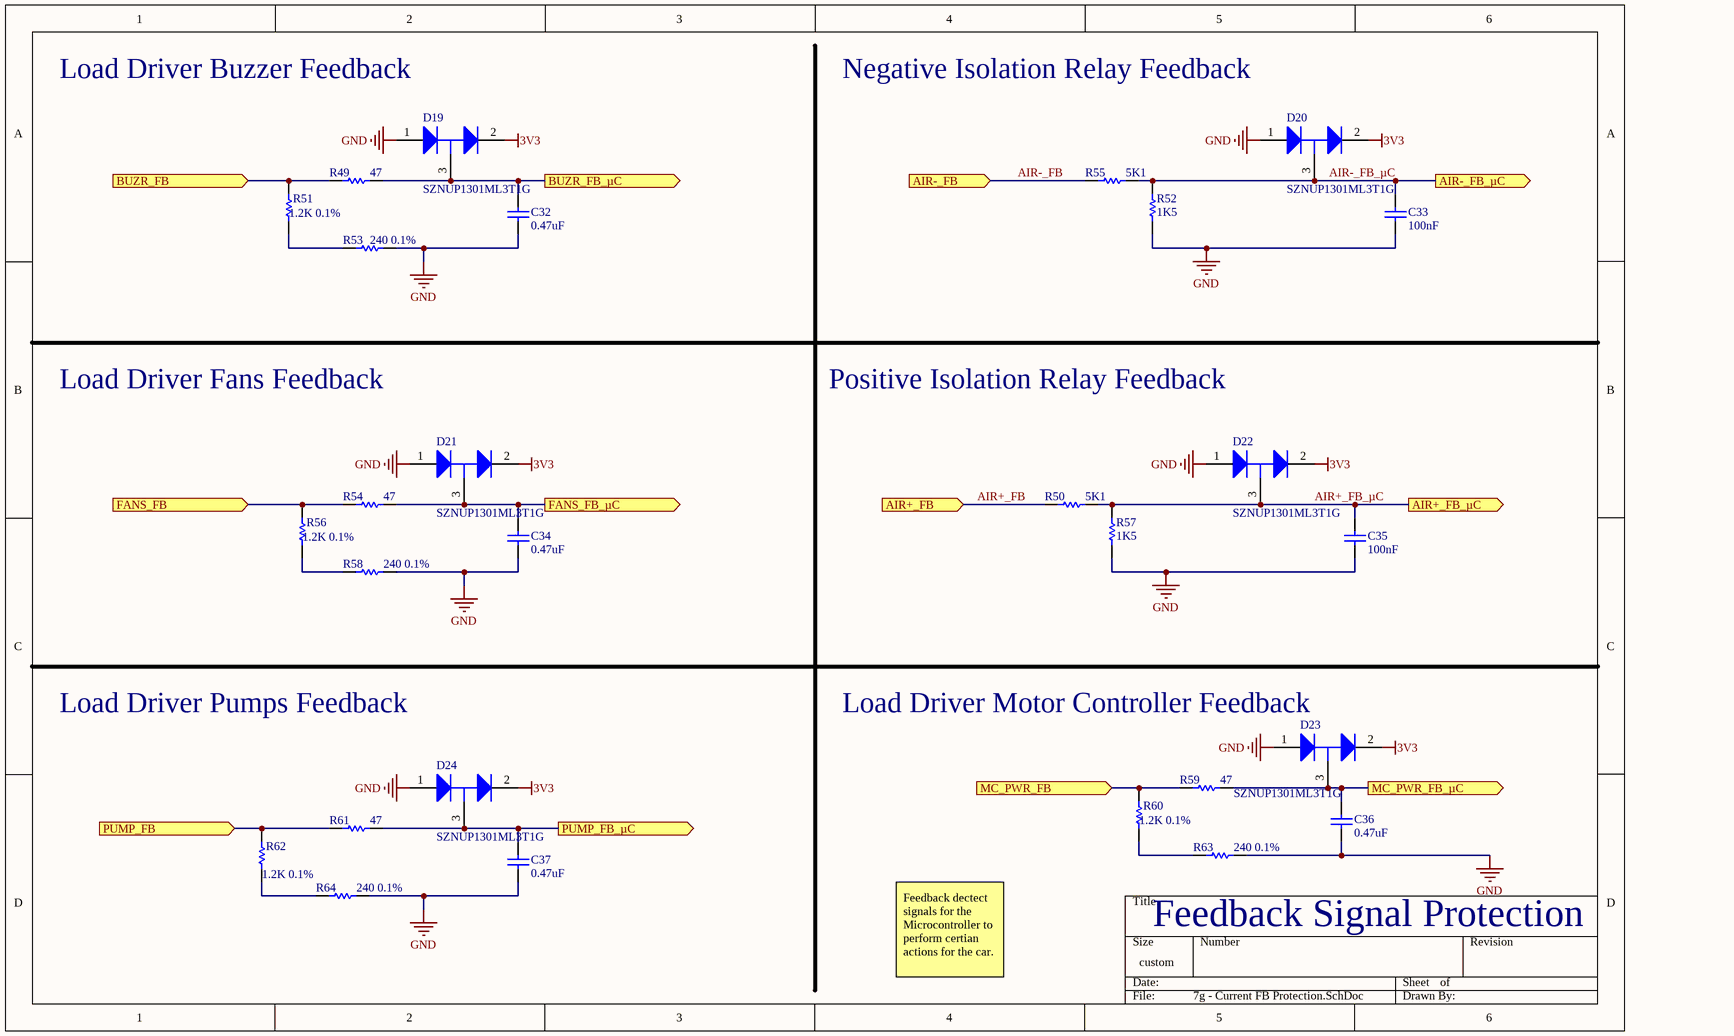
[diagram p7: 7g - Current FB Protection.SchDoc]

### Parts
C32  value 0.47uF  [1608[0603]]  (hidden comment: Cap)
C33  value 100nF  [1608[0603]]  (hidden comment: Cap)
C34  value 0.47uF  [1608[0603]]  (hidden comment: Cap)
C35  value 100nF  [1608[0603]]  (hidden comment: Cap)
C36  value 0.47uF  [1608[0603]]  (hidden comment: Cap)
C37  value 0.47uF  [1608[0603]]  (hidden comment: Cap)
D19  SZNUP1301ML3T1G  [ONSC-SOT-23-3-318-08_V]
D20  SZNUP1301ML3T1G  [ONSC-SOT-23-3-318-08_V]
D21  SZNUP1301ML3T1G  [ONSC-SOT-23-3-318-08_V]
D22  SZNUP1301ML3T1G  [ONSC-SOT-23-3-318-08_V]
D23  SZNUP1301ML3T1G  [ONSC-SOT-23-3-318-08_V]
D24  SZNUP1301ML3T1G  [ONSC-SOT-23-3-318-08_V]
R49  value 47  [1608[0603]]  (hidden comment: Res1)
R50  value 5K1  [1608[0603]]  (hidden comment: Res1)
R51  value 1.2K 0.1%  [1608[0603]]  (hidden comment: Res1)
R52  value 1K5  [1608[0603]]  (hidden comment: Res1)
R53  value 240 0.1%  [1608[0603]]  (hidden comment: Res1)
R54  value 47  [1608[0603]]  (hidden comment: Res1)
R55  value 5K1  [1608[0603]]  (hidden comment: Res1)
R56  value 1.2K 0.1%  [1608[0603]]  (hidden comment: Res1)
R57  value 1K5  [1608[0603]]  (hidden comment: Res1)
R58  value 240 0.1%  [1608[0603]]  (hidden comment: Res1)
R59  value 47  [1608[0603]]  (hidden comment: Res1)
R60  value 1.2K 0.1%  [1608[0603]]  (hidden comment: Res1)
R61  value 47  [1608[0603]]  (hidden comment: Res1)
R62  value 1.2K 0.1%  [1608[0603]]  (hidden comment: Res1)
R63  value 240 0.1%  [1608[0603]]  (hidden comment: Res1)
R64  value 240 0.1%  [1608[0603]]  (hidden comment: Res1)

### Ports
AIR+_FB (in), AIR+_FB_µC (out), AIR-_FB (in), AIR-_FB_µC (out), BUZR_FB (in), BUZR_FB_µC (out), FANS_FB (in), FANS_FB_µC (out), MC_PWR_FB (in), MC_PWR_FB_µC (out), PUMP_FB (in), PUMP_FB_µC (out)

### Nets
3V3: D19.2(K) D20.2(K) D21.2(K) D22.2(K) D23.2(K) D24.2(K)
GND: C32.1 C33.1 C34.1 C35.1 C36.1 C37.1 D19.1(A) D20.1(A) D21.1(A) D22.1(A) D23.1(A) D24.1(A) R52.1 R53.2 R57.1 R58.2 R63.2 R64.2
AIR+_FB: R50.1 ; port AIR+_FB
AIR+_FB_µC: C35.2 D22.3(K/A) R50.2 R57.2 ; port AIR+_FB_µC
AIR-_FB: R55.1 ; port AIR-_FB
AIR-_FB_µC: C33.2 D20.3(K/A) R52.2 R55.2 ; port AIR-_FB_µC
BUZR_FB: R49.1 R51.2 ; port BUZR_FB
BUZR_FB_µC: C32.2 D19.3(K/A) R49.2 ; port BUZR_FB_µC
FANS_FB: R54.1 R56.2 ; port FANS_FB
FANS_FB_µC: C34.2 D21.3(K/A) R54.2 ; port FANS_FB_µC
MC_PWR_FB: R59.1 R60.2 ; port MC_PWR_FB
MC_PWR_FB_µC: C36.2 D23.3(K/A) R59.2 ; port MC_PWR_FB_µC
PUMP_FB: R61.1 R62.2 ; port PUMP_FB
PUMP_FB_µC: C37.2 D24.3(K/A) R61.2 ; port PUMP_FB_µC
NetR51_1: R51.1 R53.1
NetR56_1: R56.1 R58.1
NetR60_1: R60.1 R63.1
NetR62_1: R62.1 R64.1

### Notes on the sheet
- Load Driver Buzzer Feedback
- Negative Isolation Relay Feedback
- Load Driver Fans Feedback
- Positive Isolation Relay Feedback
- Load Driver Pumps Feedback
- (near D23) Load Driver Motor Controller Feedback
- Feedback dectect signals for the Microcontroller to perform certian actions for the car.
- (near R63) Feedback Signal Protection

### Library data of the parts
C32-C37 = Cap: Capacitor; Published: 8-Jun-2000; LatestRevisionDate: 17-Jul-2002; LatestRevisionNote: Re-released for DXP Platform.; PackageReference: RAD-0.3; Publisher: Altium Limited; PackageDescription: Radial Cap, Thru-Hole; 2 Leads; 0.3 in Pin Spacing
D19-D24 = CMP-1063-00171-1: as D4 on sheet 7b - High Current Path Detection; Mounting Technology: Surface Mount; PackageReference: SOT-23-3-318-08; DatasheetVersion: Rev. 6; PackageVersion: Rev. AP, 11/2009; RoHS: Pb-Free; ComponentLink1Description: Manufacturer URL; ComponentLink1URL: http://www.onsemi.com/; PackageDescription: 3-Pin Small Outline Transistor, Body 2.92 x 1.3 mm, Pitch 0.95 mm; PartNumber: SZNUP1301ML3T1G; Packing: Tape and Reel; ComponentLink3URL: http://www.onsemi.cn/pub_link/Collateral/318-08.PDF; ComponentLink3Description: Package Specification; VRWM Max (V): 70; ComponentLink2Description: Datasheet; ComponentLink2URL: http://www.onsemi.cn/pub_link/Collateral/NUP1301ML3T1-D.PDF
R49-R64 = Res1: Resistor; Published: 8-Jun-2000; LatestRevisionDate: 17-Jul-2002; LatestRevisionNote: Re-released for DXP Platform.; PackageReference: AXIAL-0.3; Publisher: Altium Limited; PackageDescription: Axial Device, Thru-Hole; 2 Leads; 0.3 in Pin Spacing

## Sheet 7h - Software Communication.SchDoc
size A4
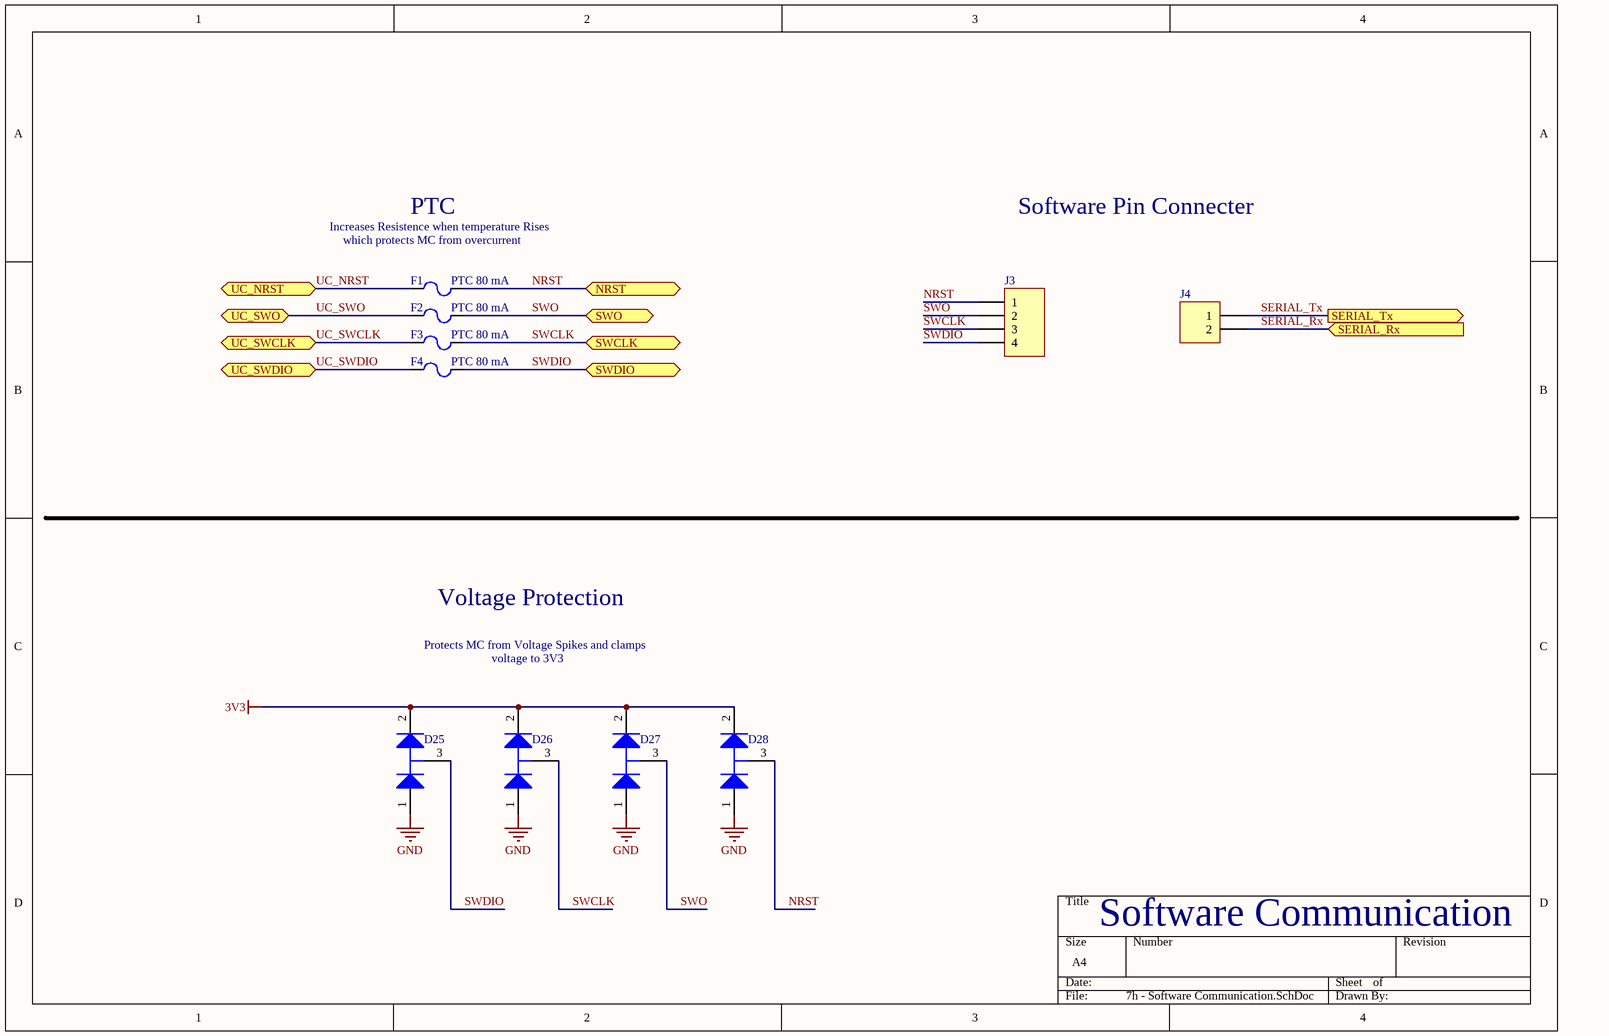
[diagram p8: 7h - Software Communication.SchDoc]

### Parts
D25  SZNUP1301ML3T1G  [ONSC-SOT-23-3-318-08_V]  (value not drawn)
D26  SZNUP1301ML3T1G  [ONSC-SOT-23-3-318-08_V]  (value not drawn)
D27  SZNUP1301ML3T1G  [ONSC-SOT-23-3-318-08_V]  (value not drawn)
D28  SZNUP1301ML3T1G  [ONSC-SOT-23-3-318-08_V]  (value not drawn)
F1  PTC 80 mA  [FUSC1608X100N]
F2  PTC 80 mA  [FUSC1608X100N]
F3  PTC 80 mA  [FUSC1608X100N]
F4  PTC 80 mA  [FUSC1608X100N]
J3  Header 4  [HDR1X4]  (value not drawn)
J4  (no value)  [HDR1X2]

### Ports
NRST (bidir), SERIAL_Rx (in), SERIAL_Tx (out), SWCLK (bidir), SWDIO (bidir), SWO (bidir), UC_NRST (bidir), UC_SWCLK (bidir), UC_SWDIO (bidir), UC_SWO (bidir)

### Nets
3V3: D25.2(K) D26.2(K) D27.2(K) D28.2(K)
GND: D25.1(A) D26.1(A) D27.1(A) D28.1(A)
NRST: D28.3(K/A) F1.2 J3.1 ; port NRST
SERIAL_Rx: J4.2 ; port SERIAL_Rx
SERIAL_Tx: J4.1 ; port SERIAL_Tx
SWCLK: D26.3(K/A) F3.2 J3.3 ; port SWCLK
SWDIO: D25.3(K/A) F4.2 J3.4 ; port SWDIO
SWO: D27.3(K/A) F2.2 J3.2 ; port SWO
UC_NRST: F1.1 ; port UC_NRST
UC_SWCLK: F3.1 ; port UC_SWCLK
UC_SWDIO: F4.1 ; port UC_SWDIO
UC_SWO: F2.1 ; port UC_SWO

### Notes on the sheet
- Increases Resistence when temperature Rises
- (near F1) which protects MC from overcurrent
- PTC
- Software Pin Connecter
- Protects MC from Voltage Spikes and clamps
- Voltage Protection
- voltage to 3V3
- Software Communication

### Library data of the parts
D25-D28 = CMP-1063-00171-1: as D4 on sheet 7b - High Current Path Detection; Mounting Technology: Surface Mount; PackageReference: SOT-23-3-318-08; DatasheetVersion: Rev. 6; PackageVersion: Rev. AP, 11/2009; RoHS: Pb-Free; ComponentLink1Description: Manufacturer URL; ComponentLink1URL: http://www.onsemi.com/; PackageDescription: 3-Pin Small Outline Transistor, Body 2.92 x 1.3 mm, Pitch 0.95 mm; PartNumber: SZNUP1301ML3T1G; Packing: Tape and Reel; ComponentLink3URL: http://www.onsemi.cn/pub_link/Collateral/318-08.PDF; ComponentLink3Description: Package Specification; VRWM Max (V): 70; ComponentLink2Description: Datasheet; ComponentLink2URL: http://www.onsemi.cn/pub_link/Collateral/NUP1301ML3T1-D.PDF; Supplier 1: Mouser; Supplier Part Number 1: 863-SZNUP1301ML3T1G
F1-F4 = PTC fuse 80mA 0ZCM0008FF2G: 0ZCM0008FF2G; Supplier 1: Digi-Key; Supplier Part Number 1: 507-1817-1-ND
J3 = Header 4: Header, 4-Pin; LatestRevisionDate: 17-Jul-2002; LatestRevisionNote: Re-released for DXP Platform.; Publisher: Altium Limited
J4 = Header 2: Header, 2-Pin; LatestRevisionDate: 17-Jul-2002; LatestRevisionNote: Re-released for DXP Platform.; Publisher: Altium Limited